# EAGLE board BeagleBone_Black_Wireless (EAGLE 7.6.0), part 1 of 3
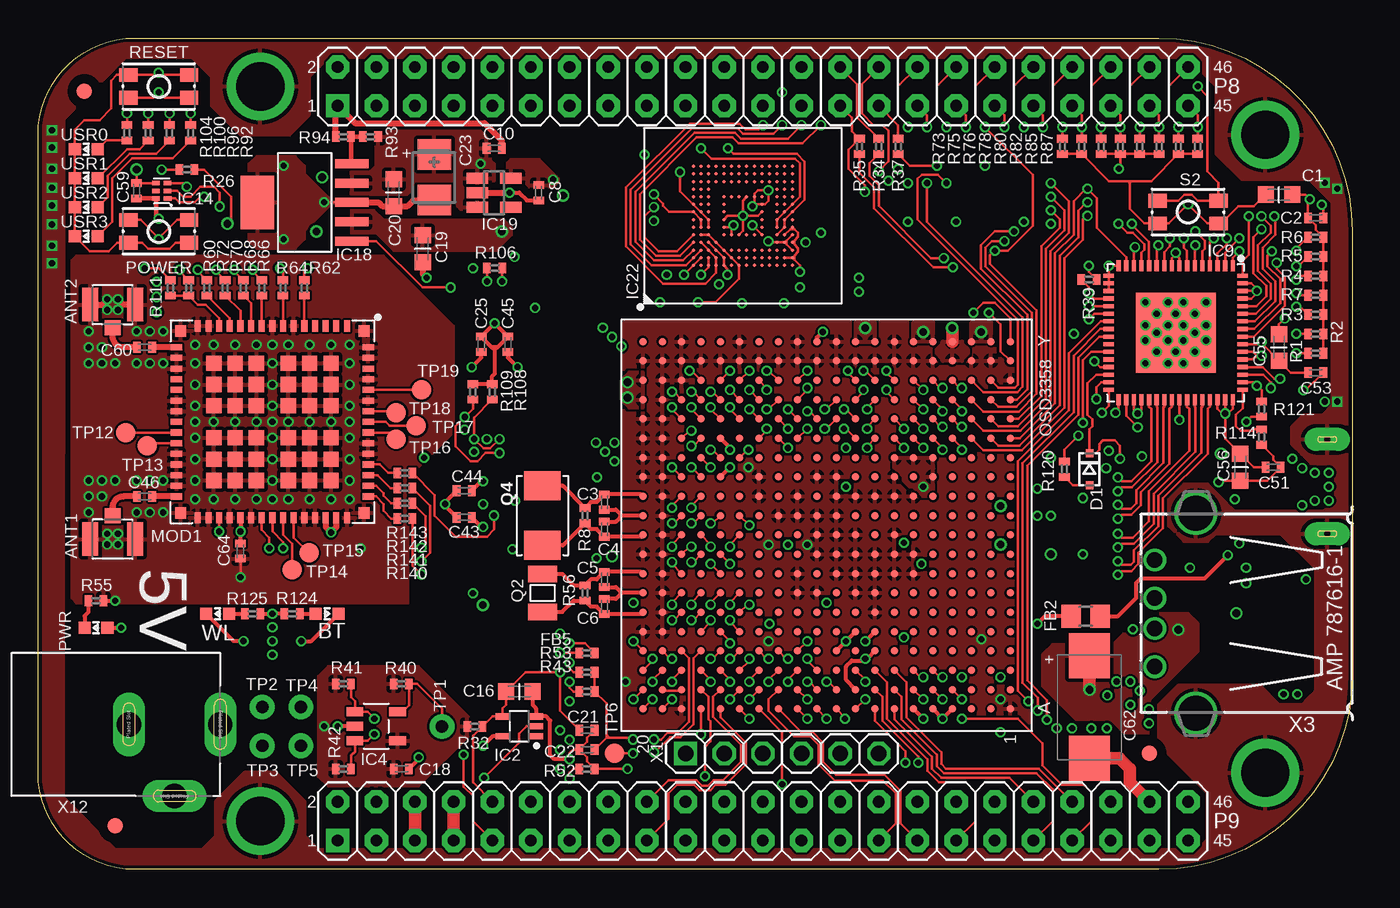
[diagram p5: board, top side]
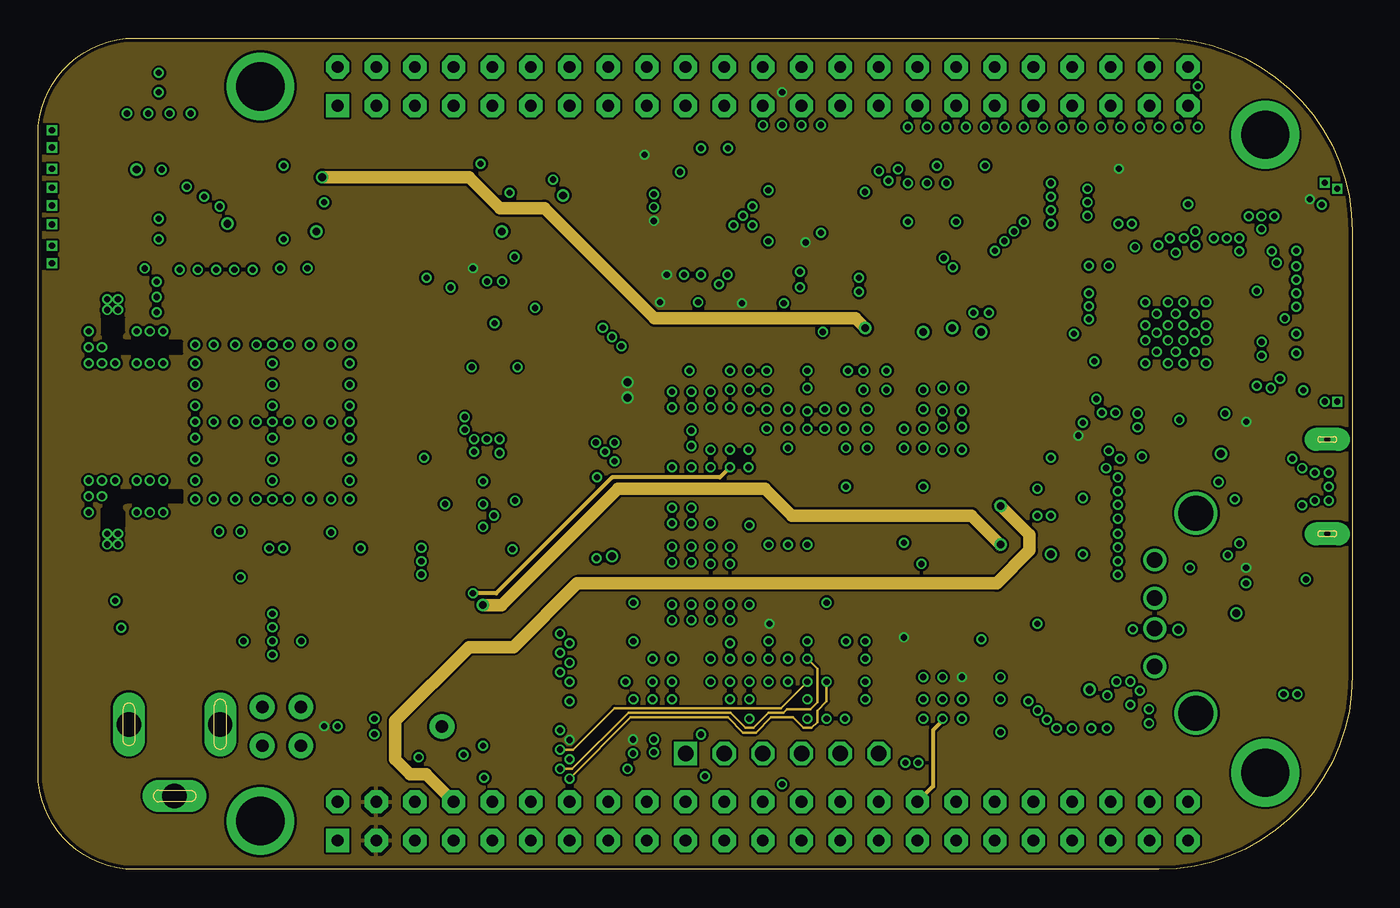
[diagram p6: board, inner layer VDD]
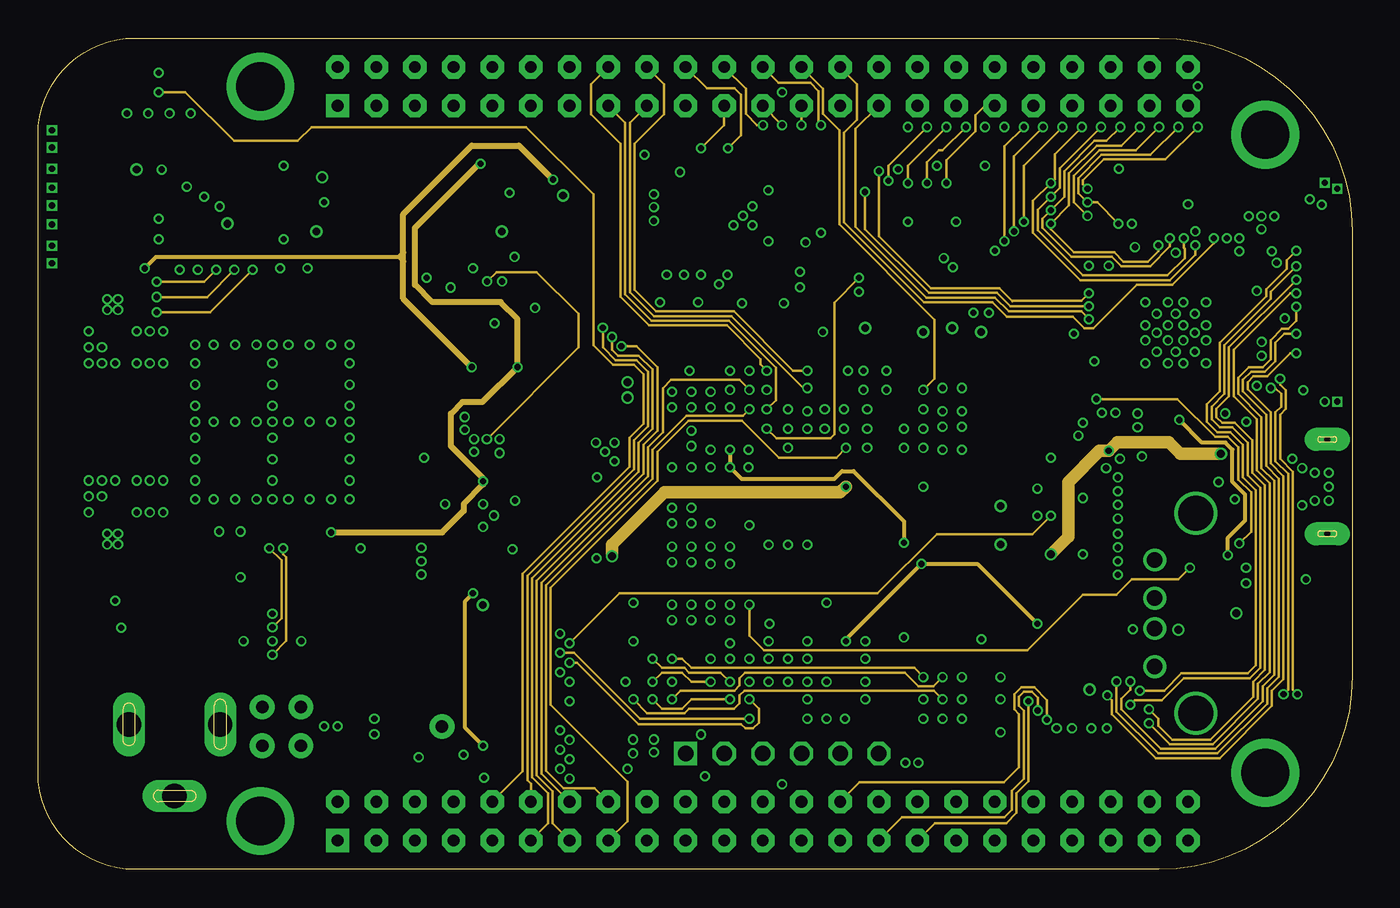
[diagram p7: board, inner layer Route3]
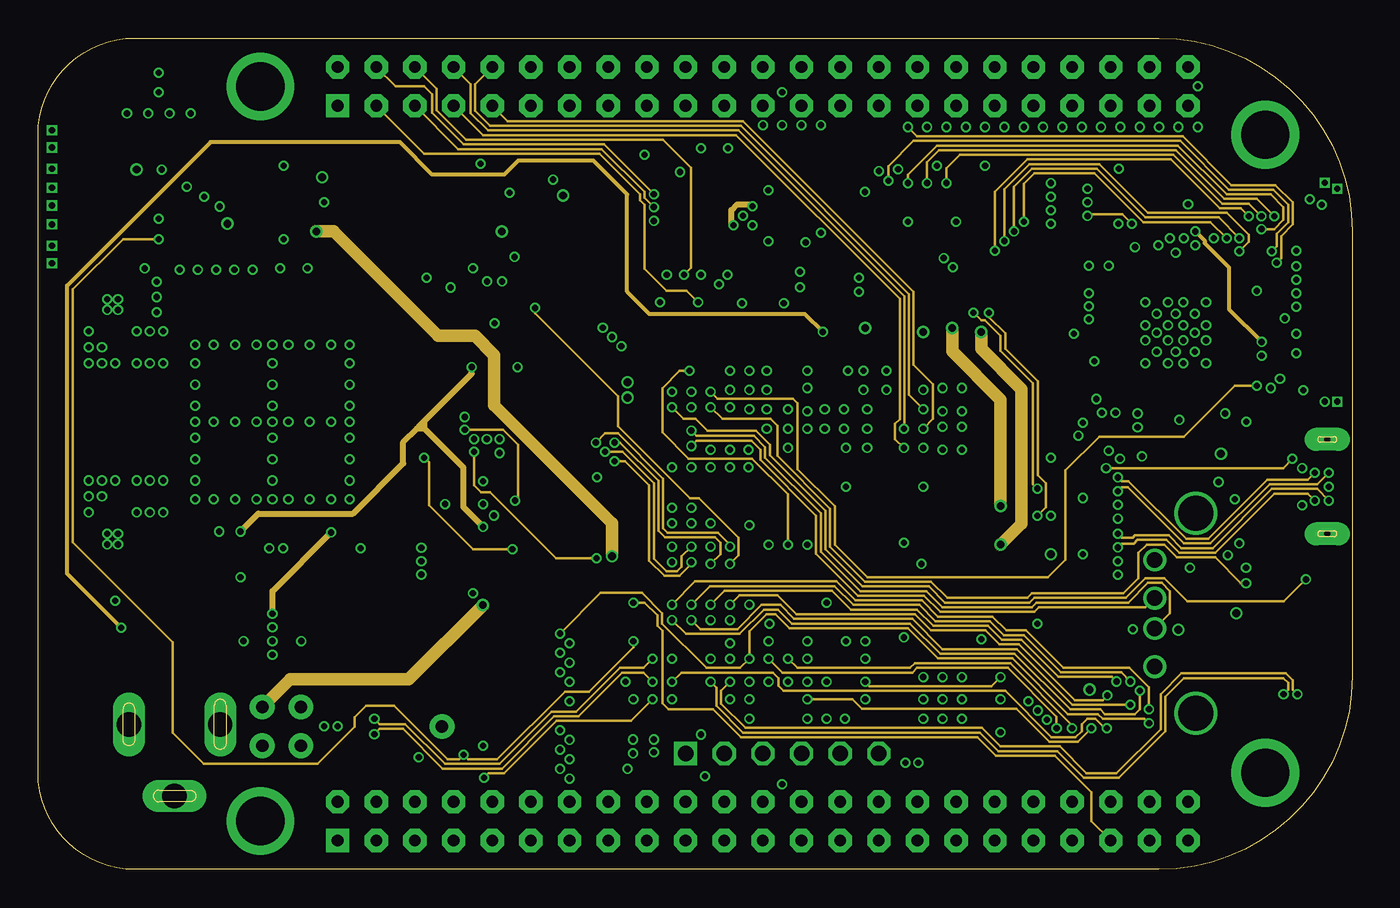
[diagram p8: board, inner layer Route14]
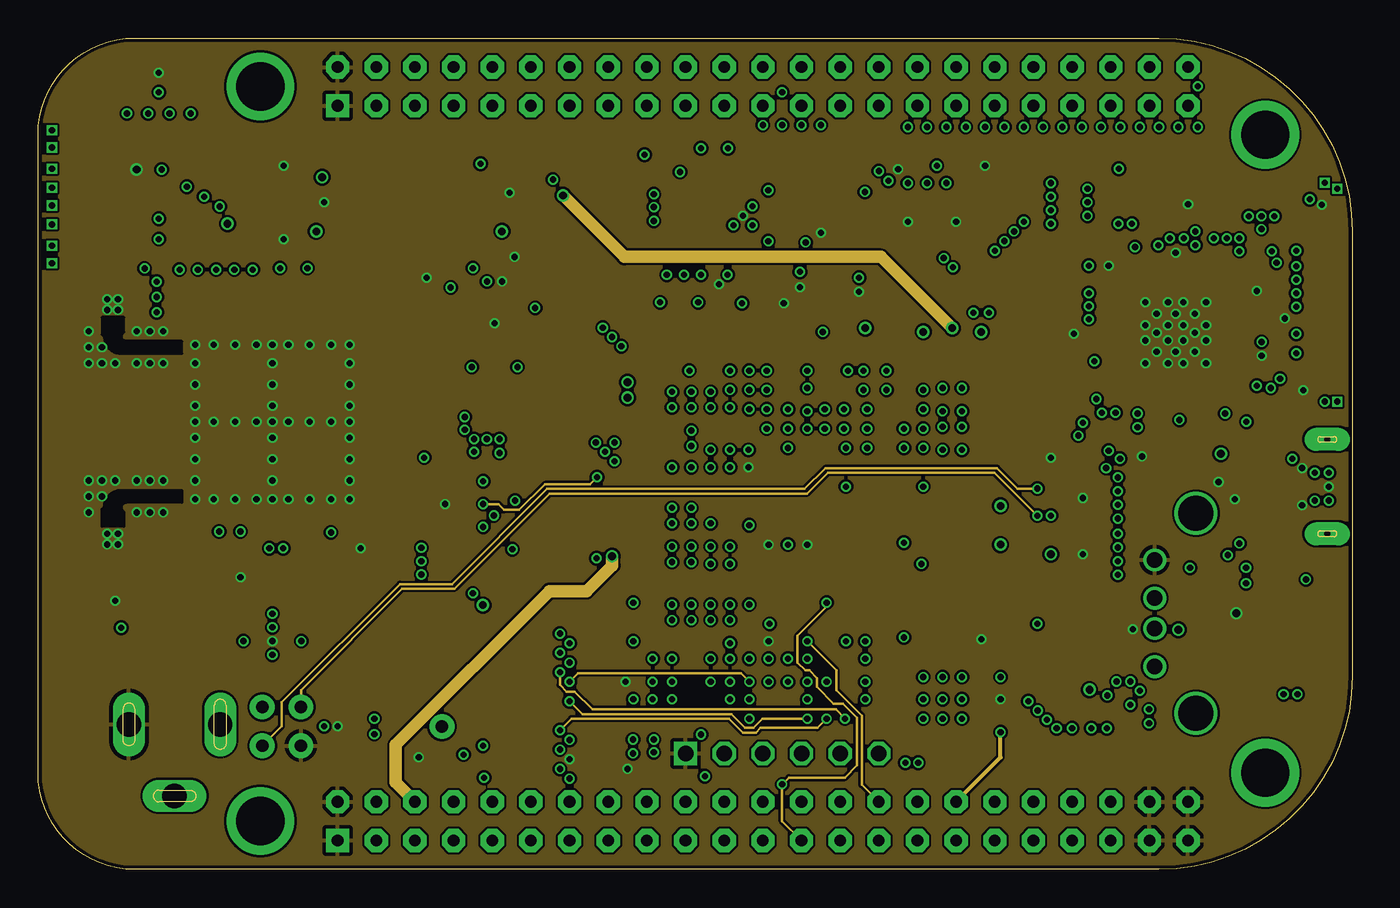
[diagram p9: board, inner layer DigitalGND]
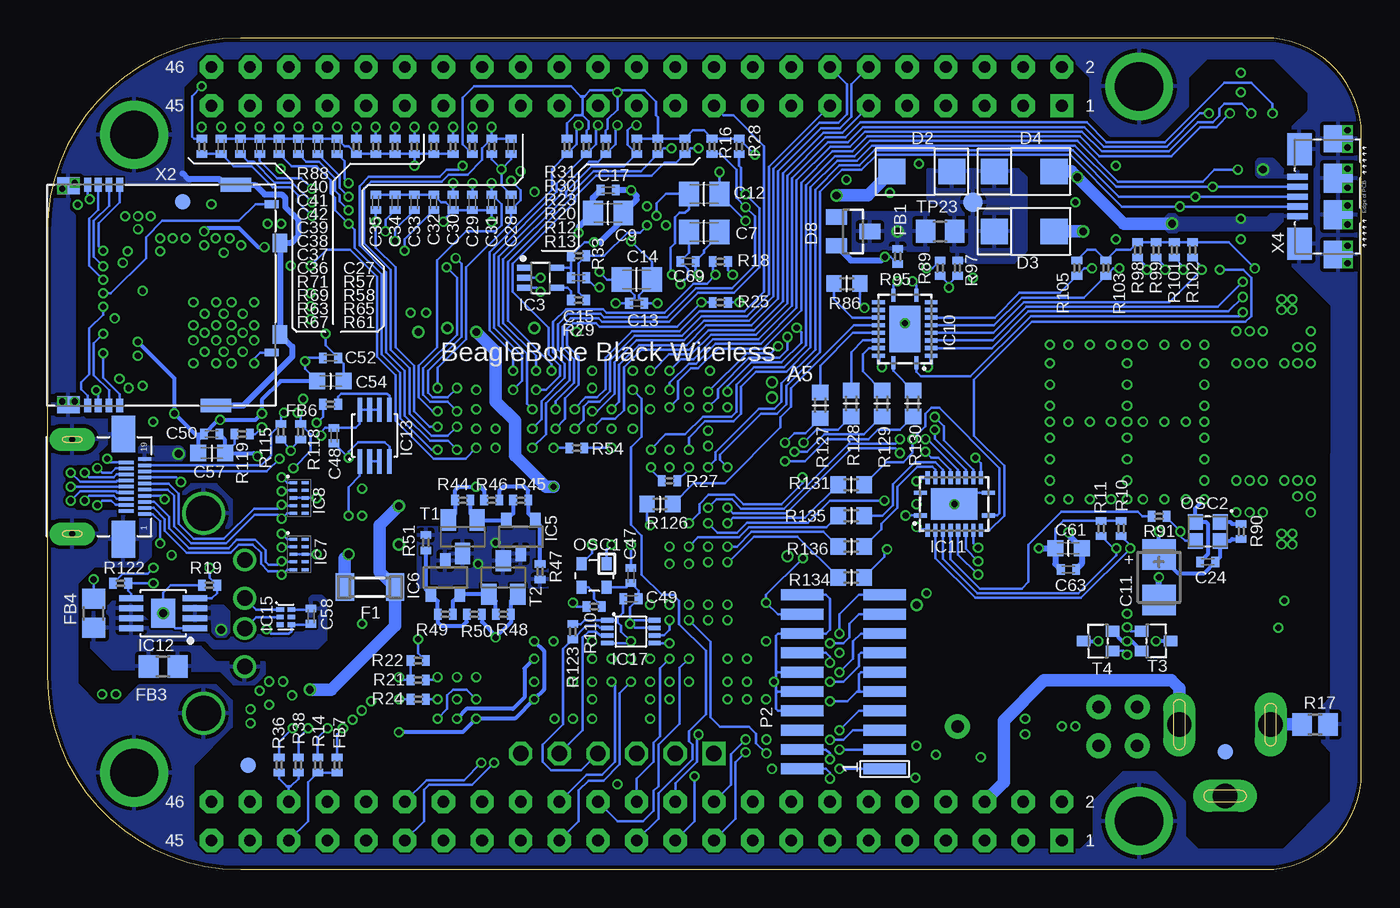
[diagram p10: board, bottom side, seen from below]

Size 86.36 x 54.61 mm. Coordinates in mm from the lower left corner, seen from the top.
Outline: 0,6.35 0,48.26 arc-90 6.35,54.61 73.66,54.61 arc-90 86.36,41.91 86.36,12.7 arc-90 73.66,0 6.35,0 arc-90 0,6.35
Copper layers (1+2+3+14+15+16): Top 0.035mm / dielectric 1.5mm / VDD 0.035mm / dielectric 0.15mm / Route3 0.035mm / dielectric 0.2mm / Route14 0.035mm / dielectric 0.15mm / DigitalGND 0.035mm / dielectric 0.2mm / Bottom 0.035mm
Design rules "default *": minimum track width 6mil, minimum drill 10mil, track to track 6mil, track to pad 6mil, pad to pad 6mil, via to via 6mil, smd to smd 6mil, copper to edge 10mil, drill to drill 8mil, minimum pad ring 10mil, minimum via ring 5mil, stop-mask expansion 4mil, vias tented up to drill 40mil, thermal gap 10mil

## Footprints (pad centres in the part's own frame; a part is rotated, then mirrored left to right if it is on the bottom)
U.FL-R-SMT-1 = smd 1.05 x 2.2: GND1 -1.475,0; GND2 1.475,0 | smd 1.05 x 1: SIG 0,-1.525
0603-LED = smd 0.8 x 0.8: A 0,0.75; K 0,-0.75
C0603K = smd 1.05 x 1.08: 1 -0.875,0; 2 0.875,0
C0402K = smd 0.5 x 0.7: 1 -0.5,0; 2 0.5,0
C0805K = smd 1.3 x 1.6: 1 -1,0; 2 1,0
CT3528 = smd 2 x 2.2: + -1.5,0; - 1.5,0
D/7343-31W = smd 2.95 x 2.7: + 3.375,0; - -3.375,0
SOD323(NXP)REFLOW = smd 0.5 x 0.5: A 1.05,0; C -1.05,0
DIODE_SMA = smd 1.778 x 1.676: A -1.905,0; K 2.032,0
SOT23 = smd 1 x 1.4: 1 -0.95,-1.1; 2 0.95,-1.1; 3 0,1.1
SM-1206 = smd 1.2 x 1.8: 1 -1.65,0; 2 1.65,0
0805-RESISTOR = smd 1.3 x 1.5: 1 -0.95,0; 2 0.95,0
R0402 = smd 0.5 x 0.7: 1 -0.5,0; 2 0.5,0
FIDUCIAL_40MIL = smd 1.016 x 1.016: P$1 0,0
OSD3358 = smd 0.5 x 0.5: A1 -12.065,-12.065; A2 -12.065,-10.795; A3 -12.065,-9.525; A4 -12.065,-8.255; A5 -12.065,-6.985; A6 -12.065,-5.715; A7 -12.065,-4.445; A8 -12.065,-3.175; A9 -12.065,-1.905; A10 -12.065,-0.635; A11 -12.065,0.635; A12 -12.065,1.905; A13 -12.065,3.175; A14 -12.065,4.445; A15 -12.065,5.715; A16 -12.065,6.985; A17 -12.065,8.255; A18 -12.065,9.525; A19 -12.065,10.795; A20 -12.065,12.065; B1 -10.795,-12.065; B2 -10.795,-10.795; B3 -10.795,-9.525; B4 -10.795,-8.255; B5 -10.795,-6.985; B6 -10.795,-5.715; B7 -10.795,-4.445; B8 -10.795,-3.175; B9 -10.795,-1.905; B10 -10.795,-0.635; B11 -10.795,0.635; B12 -10.795,1.905; B13 -10.795,3.175; B14 -10.795,4.445; B15 -10.795,5.715; B16 -10.795,6.985; B17 -10.795,8.255; B18 -10.795,9.525; B19 -10.795,10.795; B20 -10.795,12.065; C1 -9.525,-12.065; C2 -9.525,-10.795; C3 -9.525,-9.525; C4 -9.525,-8.255; C5 -9.525,-6.985; C6 -9.525,-5.715; C7 -9.525,-4.445; C8 -9.525,-3.175; C9 -9.525,-1.905; C10 -9.525,-0.635; C11 -9.525,0.635; C12 -9.525,1.905; C13 -9.525,3.175; C14 -9.525,4.445; C15 -9.525,5.715; C16 -9.525,6.985; C17 -9.525,8.255; C18 -9.525,9.525; C19 -9.525,10.795; C20 -9.525,12.065; D1 -8.255,-12.065; D2 -8.255,-10.795; D3 -8.255,-9.525; D4 -8.255,-8.255; D5 -8.255,-6.985; D6 -8.255,-5.715; D7 -8.255,-4.445; D8 -8.255,-3.175; D9 -8.255,-1.905; D10 -8.255,-0.635; D11 -8.255,0.635; D12 -8.255,1.905; D13 -8.255,3.175; D14 -8.255,4.445; D15 -8.255,5.715; D16 -8.255,6.985; D17 -8.255,8.255; D18 -8.255,9.525; D19 -8.255,10.795; D20 -8.255,12.065; E1 -6.985,-12.065; E2 -6.985,-10.795; E3 -6.985,-9.525; E4 -6.985,-8.255; E5 -6.985,-6.985; E6 -6.985,-5.715; E7 -6.985,-4.445; E8 -6.985,-3.175; E9 -6.985,-1.905; E10 -6.985,-0.635; E11 -6.985,0.635; E12 -6.985,1.905; E13 -6.985,3.175; E14 -6.985,4.445; E15 -6.985,5.715; E16 -6.985,6.985; E17 -6.985,8.255; E18 -6.985,9.525; E19 -6.985,10.795; E20 -6.985,12.065; F1 -5.715,-12.065; F2 -5.715,-10.795; F3 -5.715,-9.525; F4 -5.715,-8.255; F5 -5.715,-6.985; F6 -5.715,-5.715; F7 -5.715,-4.445; F8 -5.715,-3.175; F9 -5.715,-1.905; F10 -5.715,-0.635; F11 -5.715,0.635; F12 -5.715,1.905; F13 -5.715,3.175; F14 -5.715,4.445; F15 -5.715,5.715; F16 -5.715,6.985; F17 -5.715,8.255; F18 -5.715,9.525; F19 -5.715,10.795; F20 -5.715,12.065; G1 -4.445,-12.065; G2 -4.445,-10.795; G3 -4.445,-9.525; G4 -4.445,-8.255; G5 -4.445,-6.985; G6 -4.445,-5.715; G7 -4.445,-4.445; G8 -4.445,-3.175; G9 -4.445,-1.905; G10 -4.445,-0.635; G11 -4.445,0.635; G12 -4.445,1.905; G13 -4.445,3.175; G14 -4.445,4.445; G15 -4.445,5.715; G16 -4.445,6.985; G17 -4.445,8.255; G18 -4.445,9.525; G19 -4.445,10.795; G20 -4.445,12.065; H1 -3.175,-12.065; H2 -3.175,-10.795; H3 -3.175,-9.525; H4 -3.175,-8.255; H5 -3.175,-6.985; H6 -3.175,-5.715; H7 -3.175,-4.445; H8 -3.175,-3.175; H9 -3.175,-1.905; H10 -3.175,-0.635; H11 -3.175,0.635; H12 -3.175,1.905; H13 -3.175,3.175; H14 -3.175,4.445; H15 -3.175,5.715; H16 -3.175,6.985; H17 -3.175,8.255; H18 -3.175,9.525; H19 -3.175,10.795; H20 -3.175,12.065; J1 -1.905,-12.065; J2 -1.905,-10.795; J3 -1.905,-9.525; J4 -1.905,-8.255; J5 -1.905,-6.985; J6 -1.905,-5.715; J7 -1.905,-4.445; J8 -1.905,-3.175; J9 -1.905,-1.905; J10 -1.905,-0.635; J11 -1.905,0.635; J12 -1.905,1.905; J13 -1.905,3.175; J14 -1.905,4.445; J15 -1.905,5.715; J16 -1.905,6.985; J17 -1.905,8.255; J18 -1.905,9.525; J19 -1.905,10.795; J20 -1.905,12.065; K1 -0.635,-12.065; K2 -0.635,-10.795; K3 -0.635,-9.525; K4 -0.635,-8.255; K5 -0.635,-6.985; K6 -0.635,-5.715; K7 -0.635,-4.445; K8 -0.635,-3.175; K9 -0.635,-1.905; K10 -0.635,-0.635; K11 -0.635,0.635; K12 -0.635,1.905; K13 -0.635,3.175; K14 -0.635,4.445; K15 -0.635,5.715; K16 -0.635,6.985; K17 -0.635,8.255; K18 -0.635,9.525; K19 -0.635,10.795; K20 -0.635,12.065; L1 0.635,-12.065; L2 0.635,-10.795; L3 0.635,-9.525; L4 0.635,-8.255; L5 0.635,-6.985; L6 0.635,-5.715; L7 0.635,-4.445; L8 0.635,-3.175; L9 0.635,-1.905; L10 0.635,-0.635; L11 0.635,0.635; L12 0.635,1.905; L13 0.635,3.175; L14 0.635,4.445; L15 0.635,5.715; L16 0.635,6.985; L17 0.635,8.255; L18 0.635,9.525; L19 0.635,10.795; L20 0.635,12.065; M1 1.905,-12.065; M2 1.905,-10.795; M3 1.905,-9.525; M4 1.905,-8.255; M5 1.905,-6.985; M6 1.905,-5.715; M7 1.905,-4.445; M8 1.905,-3.175; M9 1.905,-1.905; M10 1.905,-0.635; M11 1.905,0.635; M12 1.905,1.905; M13 1.905,3.175; M14 1.905,4.445; M15 1.905,5.715; M16 1.905,6.985; M17 1.905,8.255; M18 1.905,9.525; M19 1.905,10.795; M20 1.905,12.065; N1 3.175,-12.065; N2 3.175,-10.795; N3 3.175,-9.525; N4 3.175,-8.255; N5 3.175,-6.985; N6 3.175,-5.715; N7 3.175,-4.445; N8 3.175,-3.175; N9 3.175,-1.905; N10 3.175,-0.635; N11 3.175,0.635; N12 3.175,1.905; N13 3.175,3.175; N14 3.175,4.445; N15 3.175,5.715; N16 3.175,6.985; N17 3.175,8.255; N18 3.175,9.525; N19 3.175,10.795; N20 3.175,12.065; P1 4.445,-12.065; P2 4.445,-10.795; P3 4.445,-9.525; P4 4.445,-8.255; P5 4.445,-6.985; P6 4.445,-5.715; P7 4.445,-4.445; P8 4.445,-3.175; P9 4.445,-1.905; P10 4.445,-0.635; P11 4.445,0.635; P12 4.445,1.905; P13 4.445,3.175; P14 4.445,4.445; P15 4.445,5.715; P16 4.445,6.985; P17 4.445,8.255; P18 4.445,9.525; P19 4.445,10.795; P20 4.445,12.065; R1 5.715,-12.065; R2 5.715,-10.795; R3 5.715,-9.525; R4 5.715,-8.255; R5 5.715,-6.985; R6 5.715,-5.715; R7 5.715,-4.445; R8 5.715,-3.175; R9 5.715,-1.905; R10 5.715,-0.635; R11 5.715,0.635; R12 5.715,1.905; R13 5.715,3.175; R14 5.715,4.445; R15 5.715,5.715; R16 5.715,6.985; R17 5.715,8.255; R18 5.715,9.525; R19 5.715,10.795; R20 5.715,12.065; T1 6.985,-12.065; T2 6.985,-10.795; T3 6.985,-9.525; T4 6.985,-8.255; T5 6.985,-6.985; T6 6.985,-5.715; T7 6.985,-4.445; T8 6.985,-3.175; T9 6.985,-1.905; T10 6.985,-0.635; T11 6.985,0.635; T12 6.985,1.905; T13 6.985,3.175; T14 6.985,4.445; T15 6.985,5.715; T16 6.985,6.985; T17 6.985,8.255; T18 6.985,9.525; T19 6.985,10.795; T20 6.985,12.065; U1 8.255,-12.065; U2 8.255,-10.795; U3 8.255,-9.525; U4 8.255,-8.255; U5 8.255,-6.985; U6 8.255,-5.715; U7 8.255,-4.445; U8 8.255,-3.175; U9 8.255,-1.905; U10 8.255,-0.635; U11 8.255,0.635; U12 8.255,1.905; U13 8.255,3.175; U14 8.255,4.445; U15 8.255,5.715; U16 8.255,6.985; U17 8.255,8.255; U18 8.255,9.525; U19 8.255,10.795; U20 8.255,12.065; V1 9.525,-12.065; V2 9.525,-10.795; V3 9.525,-9.525; V4 9.525,-8.255; V5 9.525,-6.985; V6 9.525,-5.715; V7 9.525,-4.445; V8 9.525,-3.175; V9 9.525,-1.905; V10 9.525,-0.635; V11 9.525,0.635; V12 9.525,1.905; V13 9.525,3.175; V14 9.525,4.445; V15 9.525,5.715; V16 9.525,6.985; V17 9.525,8.255; V18 9.525,9.525; V19 9.525,10.795; V20 9.525,12.065; W1 10.795,-12.065; W2 10.795,-10.795; W3 10.795,-9.525; W4 10.795,-8.255; W5 10.795,-6.985; W6 10.795,-5.715; W7 10.795,-4.445; W8 10.795,-3.175; W9 10.795,-1.905; W10 10.795,-0.635; W11 10.795,0.635; W12 10.795,1.905; W13 10.795,3.175; W14 10.795,4.445; W15 10.795,5.715; W16 10.795,6.985; W17 10.795,8.255; W18 10.795,9.525; W19 10.795,10.795; W20 10.795,12.065; Y1 12.065,-12.065; Y2 12.065,-10.795; Y3 12.065,-9.525; Y4 12.065,-8.255; Y5 12.065,-6.985; Y6 12.065,-5.715; Y7 12.065,-4.445; Y8 12.065,-3.175; Y9 12.065,-1.905; Y10 12.065,-0.635; Y11 12.065,0.635; Y12 12.065,1.905; Y13 12.065,3.175; Y14 12.065,4.445; Y15 12.065,5.715; Y16 12.065,6.985; Y17 12.065,8.255; Y18 12.065,9.525; Y19 12.065,10.795; Y20 12.065,12.065
SC70(TI-DCK) = smd 0.4 x 0.9: 1 0.65,1.1; 2 0,1.1; 3 -0.65,1.1; 4 -0.65,-1.1; 5 0.65,-1.1
SOT23-5(MICROCHIP) = smd 0.6 x 1.1: 1 -0.95,-1.4; 2 0,-1.4; 3 0.95,-1.4; 4 0.95,1.4; 5 -0.95,1.4
DBZ_R-PDSO-G3 = smd 0.7 x 1: 1 -0.95,-1.1; 2 0.95,-1.1; 3 0,1.1
SOT1176-1(NXP) = smd 0.2 x 0.475: 1 -1,-0.388; 2 -0.5,-0.388; 3 0,-0.388; 4 0.5,-0.388; 5 1,-0.388; 6 1,0.388; 7 0.5,0.388; 8 0,0.388; 9 -0.5,0.388; 10 -1,0.388
SOT804-4(NXP) = smd 0.7 x 0.275: 1 -4.4,3.75; 2 -4.4,3.25; 3 -4.4,2.75; 4 -4.4,2.25; 5 -4.4,1.75; 6 -4.4,1.25; 7 -4.4,0.75; 8 -4.4,0.25; 9 -4.4,-0.25; 10 -4.4,-0.75; 11 -4.4,-1.25; 12 -4.4,-1.75; 13 -4.4,-2.25; 14 -4.4,-2.75; 15 -4.4,-3.25; 16 -4.4,-3.75; 33 4.4,-3.75; 34 4.4,-3.25; 35 4.4,-2.75; 36 4.4,-2.25; 37 4.4,-1.75; 38 4.4,-1.25; 39 4.4,-0.75; 40 4.4,-0.25; 41 4.4,0.25; 42 4.4,0.75; 43 4.4,1.25; 44 4.4,1.75; 45 4.4,2.25; 46 4.4,2.75; 47 4.4,3.25; 48 4.4,3.75 | smd 0.275 x 0.7: 17 -3.75,-4.4; 18 -3.25,-4.4; 19 -2.75,-4.4; 20 -2.25,-4.4; 21 -1.75,-4.4; 22 -1.25,-4.4; 23 -0.75,-4.4; 24 -0.25,-4.4; 25 0.25,-4.4; 26 0.75,-4.4; 27 1.25,-4.4; 28 1.75,-4.4; 29 2.25,-4.4; 30 2.75,-4.4; 31 3.25,-4.4; 32 3.75,-4.4; 49 3.75,4.4; 50 3.25,4.4; 51 2.75,4.4; 52 2.25,4.4; 53 1.75,4.4; 54 1.25,4.4; 55 0.75,4.4; 56 0.25,4.4; 57 -0.25,4.4; 58 -0.75,4.4; 59 -1.25,4.4; 60 -1.75,4.4; 61 -2.25,4.4; 62 -2.75,4.4; 63 -3.25,4.4; 64 -3.75,4.4 | smd 5.25 x 5.25: 65 0,0
R-PVQFN-N20(TI) = smd 0.85 x 0.28: 1 -2.225,-0.75; 10 2.225,-0.75; 11 2.225,0.75; 20 -2.225,0.75 | smd 0.28 x 0.85: 2 -1.75,-1.725; 3 -1.25,-1.725; 4 -0.75,-1.725; 5 -0.25,-1.725; 6 0.25,-1.725; 7 0.75,-1.725; 8 1.25,-1.725; 9 1.75,-1.725; 12 1.75,1.725; 13 1.25,1.725; 14 0.75,1.725; 15 0.25,1.725; 16 -0.25,1.725; 17 -0.75,1.725; 18 -1.25,1.725; 19 -1.75,1.725 | smd 3.05 x 2.05: TP 0,0
MSOP-POWER.PAD-8(TI) = smd 0.4 x 1.6: 1 -0.975,-2.1; 2 -0.325,-2.1; 3 0.325,-2.1; 4 0.975,-2.1; 5 0.975,2.1; 6 0.325,2.1; 7 -0.325,2.1; 8 -0.975,2.1 | smd 1.89 x 1.57: 9 0,0
SM8-8(TI) = smd 0.3 x 1.6: 1 -0.975,-1.7; 2 -0.325,-1.7; 3 0.325,-1.7; 4 0.975,-1.7; 5 0.975,1.7; 6 0.325,1.7; 7 -0.325,1.7; 8 -0.975,1.7
SON-6(TI)-DRY = smd 0.3 x 0.52: 1 -0.5,-0.38 | smd 0.3 x 0.49: 2 0,-0.375; 3 0.5,-0.375; 4 0.5,0.375; 5 0,0.375; 6 -0.5,0.375
VSSOP8(TI) = smd 0.3 x 0.8: 1 -0.75,-1.55; 2 -0.25,-1.55; 3 0.25,-1.55; 4 0.75,-1.55; 5 0.75,1.55; 6 0.25,1.55; 7 -0.25,1.55; 8 -0.75,1.55
SOT-223(DCQ_R-PDSO-G6_TI) = smd 0.6 x 2.2: 1 -2.54,-3.1; 2 -1.27,-3.1; 3 0,-3.1; 4 1.27,-3.1; 5 2.54,-3.1 | smd 3.5 x 2.2: 6 0,3.1
SOT23-5 = smd 0.7 x 1.4: 1 0.95,1.1; 2 0,1.1; 3 -0.95,1.1; 4 -0.95,-1.1; 5 0.95,-1.1
MICRON_EMMC_153 = smd 0.245 x 0.245: A1 -3.25,3.25; A2 -2.75,3.25; A3 -2.25,3.25; A4 -1.75,3.25; A5 -1.25,3.25; A6 -0.75,3.25; A7 -0.25,3.25; A8 0.25,3.25; A9 0.75,3.25; A10 1.25,3.25; A11 1.75,3.25; A12 2.25,3.25; A13 2.75,3.25; A14 3.25,3.25; B1 -3.25,2.75; B2 -2.75,2.75; B3 -2.25,2.75; B4 -1.75,2.75; B5 -1.25,2.75; B6 -0.75,2.75; B7 -0.25,2.75; B8 0.25,2.75; B9 0.75,2.75; B10 1.25,2.75; B11 1.75,2.75; B12 2.25,2.75; B13 2.75,2.75; B14 3.25,2.75; C1 -3.25,2.25; C2 -2.75,2.25; C3 -2.25,2.25; C4 -1.75,2.25; C5 -1.25,2.25; C6 -0.75,2.25; C7 -0.25,2.25; C8 0.25,2.25; C9 0.75,2.25; C10 1.25,2.25; C11 1.75,2.25; C12 2.25,2.25; C13 2.75,2.25; C14 3.25,2.25; D1 -3.25,1.75; D2 -2.75,1.75; D3 -2.25,1.75; D4 -1.75,1.75; D12 2.25,1.75; D13 2.75,1.75; D14 3.25,1.75; E1 -3.25,1.25; E2 -2.75,1.25; E3 -2.25,1.25; E5 -1.25,1.25; E6 -0.75,1.25; E7 -0.25,1.25; E8 0.25,1.25; E9 0.75,1.25; E10 1.25,1.25; E12 2.25,1.25; E13 2.75,1.25; E14 3.25,1.25; F1 -3.25,0.75; F2 -2.75,0.75; F3 -2.25,0.75; F5 -1.25,0.75; F10 1.25,0.75; F12 2.25,0.75; F13 2.75,0.75; F14 3.25,0.75; G1 -3.25,0.25; G2 -2.75,0.25; G3 -2.25,0.25; G5 -1.25,0.25; G10 1.25,0.25; G12 2.25,0.25; G13 2.75,0.25; G14 3.25,0.25; H1 -3.25,-0.25; H2 -2.75,-0.25; H3 -2.25,-0.25; H5 -1.25,-0.25; H10 1.25,-0.25; H12 2.25,-0.25; H13 2.75,-0.25; H14 3.25,-0.25; J1 -3.25,-0.75; J2 -2.75,-0.75; J3 -2.25,-0.75; J5 -1.25,-0.75; J10 1.25,-0.75; J12 2.25,-0.75; J13 2.75,-0.75; J14 3.25,-0.75; K1 -3.25,-1.25; K2 -2.75,-1.25; K3 -2.25,-1.25; K5 -1.25,-1.25; K6 -0.75,-1.25; K7 -0.25,-1.25; K8 0.25,-1.25; K9 0.75,-1.25; K10 1.25,-1.25; K12 2.25,-1.25; K13 2.75,-1.25; K14 3.25,-1.25; L1 -3.25,-1.75; L2 -2.75,-1.75; L3 -2.25,-1.75; L12 2.25,-1.75; L13 2.75,-1.75; L14 3.25,-1.75; M1 -3.25,-2.25; M2 -2.75,-2.25; M3 -2.25,-2.25; M4 -1.75,-2.25; M5 -1.25,-2.25; M6 -0.75,-2.25; M7 -0.25,-2.25; M8 0.25,-2.25; M9 0.75,-2.25; M10 1.25,-2.25; M11 1.75,-2.25; M12 2.25,-2.25; M13 2.75,-2.25; M14 3.25,-2.25; N1 -3.25,-2.75; N2 -2.75,-2.75; N3 -2.25,-2.75; N4 -1.75,-2.75; N5 -1.25,-2.75; N6 -0.75,-2.75; N7 -0.25,-2.75; N8 0.25,-2.75; N9 0.75,-2.75; N10 1.25,-2.75; N11 1.75,-2.75; N12 2.25,-2.75; N13 2.75,-2.75; N14 3.25,-2.75; P1 -3.25,-3.25; P2 -2.75,-3.25; P3 -2.25,-3.25; P4 -1.75,-3.25; P5 -1.25,-3.25; P6 -0.75,-3.25; P7 -0.25,-3.25; P8 0.25,-3.25; P9 0.75,-3.25; P10 1.25,-3.25; P11 1.75,-3.25; P12 2.25,-3.25; P13 2.75,-3.25; P14 3.25,-3.25
MOUNTING_HOLE = drill 3.175 pad 4.445: P$1 0,0
MOC-100(TI) = smd 0.75 x 0.75: 1 -6.025,-5.975; 17 6.025,-5.975; 33 6.025,5.975; 49 -6.025,5.975 | smd 0.4 x 0.75: 2 -4.9,-6.3; 3 -4.2,-6.3; 4 -3.5,-6.3; 5 -2.8,-6.3; 6 -2.1,-6.3; 7 -1.4,-6.3; 8 -0.7,-6.3; 9 0,-6.3; 10 0.7,-6.3; 11 1.4,-6.3; 12 2.1,-6.3; 13 2.8,-6.3; 14 3.5,-6.3; 15 4.2,-6.3; 16 4.9,-6.3; 34 4.9,6.3; 35 4.2,6.3; 36 3.5,6.3; 37 2.8,6.3; 38 2.1,6.3; 39 1.4,6.3; 40 0.7,6.3; 41 0,6.3; 42 -0.7,6.3; 43 -1.4,6.3; 44 -2.1,6.3; 45 -2.8,6.3; 46 -3.5,6.3; 47 -4.2,6.3; 48 -4.9,6.3 | smd 0.75 x 0.4: 18 6.3,-4.9; 19 6.3,-4.2; 20 6.3,-3.5; 21 6.3,-2.8; 22 6.3,-2.1; 23 6.3,-1.4; 24 6.3,-0.7; 25 6.3,0; 26 6.3,0.7; 27 6.3,1.4; 28 6.3,2.1; 29 6.3,2.8; 30 6.3,3.5; 31 6.3,4.2; 32 6.3,4.9; 50 -6.3,4.9; 51 -6.3,4.2; 52 -6.3,3.5; 53 -6.3,2.8; 54 -6.3,2.1; 55 -6.3,1.4; 56 -6.3,0.7; 57 -6.3,0; 58 -6.3,-0.7; 59 -6.3,-1.4; 60 -6.3,-2.1; 61 -6.3,-2.8; 62 -6.3,-3.5; 63 -6.3,-4.2; 64 -6.3,-4.9 | smd 1 x 1: G1 -3.85,-3.85; G2 -2.45,-3.85; G3 -1.05,-3.85; G4 1.05,-3.85; G5 2.45,-3.85; G6 3.85,-3.85; G7 -3.85,-2.45; G8 -2.45,-2.45; G9 -1.05,-2.45; G10 1.05,-2.45; G11 2.45,-2.45; G12 3.85,-2.45; G13 -3.85,-1.05; G14 -2.45,-1.05; G15 -1.05,-1.05; G16 1.05,-1.05; G17 2.45,-1.05; G18 3.85,-1.05; G19 -3.85,1.05; G20 -2.45,1.05; G21 -1.05,1.05; G22 1.05,1.05; G23 2.45,1.05; G24 3.85,1.05; G25 -3.85,2.45; G26 -2.45,2.45; G27 -1.05,2.45; G28 1.05,2.45; G29 2.45,2.45; G30 3.85,2.45; G31 -3.85,3.85; G32 -2.45,3.85; G33 -1.05,3.85; G34 1.05,3.85; G35 2.45,3.85; G36 3.85,3.85
OSCILLATOR-2.5X2.0-BBB = smd 0.65 x 0.85: 1 -0.825,-0.775; 2 0.825,-0.775; 3 0.825,0.775; 4 -0.825,0.775
NZ2520S = smd 1 x 1: 1 -0.825,-0.625; 2 0.825,-0.625; 3 0.825,0.625; 4 -0.825,0.625
JTAG = smd 0.711 x 2.794: 1 -5.715,-2.705; 2 -5.715,2.705; 3 -4.445,-2.705; 4 -4.445,2.705; 5 -3.175,-2.705; 6 -3.175,2.705; 7 -1.905,-2.705; 8 -1.905,2.705; 9 -0.635,-2.705; 10 -0.635,2.705; 11 0.635,-2.705; 12 0.635,2.705; 13 1.905,-2.705; 14 1.905,2.705; 15 3.175,-2.705; 16 3.175,2.705; 17 4.445,-2.705; 18 4.445,2.705; 19 5.715,-2.705; 20 5.715,2.705
TH-2X23 = drill 0.762 pad 1.524 square: 1 -27.94,-1.27 | drill 0.762 pad 1.524 octagon: 2 -27.94,1.27; 3 -25.4,-1.27; 4 -25.4,1.27; 5 -22.86,-1.27; 6 -22.86,1.27; 7 -20.32,-1.27; 8 -20.32,1.27; 9 -17.78,-1.27; 10 -17.78,1.27; 11 -15.24,-1.27; 12 -15.24,1.27; 13 -12.7,-1.27; 14 -12.7,1.27; 15 -10.16,-1.27; 16 -10.16,1.27; 17 -7.62,-1.27; 18 -7.62,1.27; 19 -5.08,-1.27; 20 -5.08,1.27; 21 -2.54,-1.27; 22 -2.54,1.27; 23 0,-1.27; 24 0,1.27; 25 2.54,-1.27; 26 2.54,1.27; 27 5.08,-1.27; 28 5.08,1.27; 29 7.62,-1.27; 30 7.62,1.27; 31 10.16,-1.27; 32 10.16,1.27; 33 12.7,-1.27; 34 12.7,1.27; 35 15.24,-1.27; 36 15.24,1.27; 37 17.78,-1.27; 38 17.78,1.27; 39 20.32,-1.27; 40 20.32,1.27; 41 22.86,-1.27; 42 22.86,1.27; 43 25.4,-1.27; 44 25.4,1.27; 45 27.94,-1.27; 46 27.94,1.27
MINI_PUSHBUTTON = smd 1.2 x 0.9: 1 -2,0.75; 2 2,0.75; 3 -2,-0.75; 4 2,-0.75
CRYSTAL_3.2X1.5 = smd 1.1 x 1.9: P$1 -1.25,0; P$2 1.25,0
CRYSTAL_5X3.2MM = smd 1.9 x 2.4: 1 -1.95,0; 2 1.95,0
R0805 = smd 1.3 x 1.5: 1 -0.85,0; 2 0.85,0
R0603 = smd 1 x 1.1: 1 -0.85,0; 2 0.85,0
SOT23-BEC = smd 1 x 1.4: B -0.95,-1.1; C 0,1.1; E 0.95,-1.1
SOT-323(DIODES) = smd 0.7 x 0.9: D 0,0.95; G -0.65,-0.95; S 0.65,-0.95
TESTPAD/W_HOLE_1X1 = drill 0.813 pad 1.626: P$1 0,0
B1,27 = smd 1.27 x 1.27: TP 0,0
TH-1X6 = drill 1.016 square: 1 -6.35,0 | drill 1.016 octagon: 2 -3.81,0; 3 -1.27,0; 4 1.27,0; 5 3.81,0; 6 6.35,0
SCHA5B0200 = smd 0.9 x 0.45: 1 -7.25,3.365; 2 -7.25,2.665; 3 -7.25,1.965; 4 -7.25,1.265; 5 7.25,1.265; 6 7.25,1.965; 7 7.25,2.665; 8 7.25,3.365 | smd 0.5 x 0.9: CD -5.975,13.35; GND 3.775,13.35 | smd 0.9 x 2: CGND1 -7.25,11; CGND4 7.25,9.7 | smd 1.1 x 1.5: CGND2 -7.188,0; CGND3 7.188,0 | smd 1.2 x 0.95: CGND5 2.575,13.9; CGND6 -3.425,13.9
USB_HOST_HORIZONTAL_W/CHASSIS_GND = drill 1: 1 -3.5,12.99; 2 -1,12.99; 3 1,12.99; 4 3.5,12.99 | drill 2.3: 5 -6.57,10.28; 6 6.57,10.28
10118192-0001LF(MICRO-USB-B-AMPHENOL-FCI) = smd 1.8 x 1.9: CGND1 -3.8,0; CGND4 3.8,0 | smd 1.9 x 1.9: CGND2 -1.2,0; CGND3 1.2,0 | smd 2.1 x 1.6: CGND5 3.1,2.55; CGND6 -3.1,2.55 | smd 0.4 x 1.35: D+ 0,2.675; D- -0.65,2.675; GND 1.3,2.675; ID 0.65,2.675; VBUS -1.3,2.675
HDMI-TYPE-D-10118241 = smd 0.23 x 0.85: 1 1.8,4.765; 3 1.4,4.765; 5 1,4.765; 7 0.6,4.765; 9 0.2,4.765; 11 -0.2,4.765; 13 -0.6,4.765; 15 -1,4.765; 17 -1.4,4.765; 19 -1.8,4.765 | smd 0.23 x 1: 2 1.6,3.54; 4 1.2,3.54; 6 0.8,3.54; 8 0.4,3.54; 10 0,3.54; 12 -0.4,3.54; 14 -0.8,3.54; 16 -1.2,3.54; 18 -1.6,3.54 | drill 0.381 pad 1.5 long: CG1 3.1,0; CG2 -3.1,0 | smd 2.413 x 1.524: CG3 3.45,3.36; CG4 -3.45,3.36
PJ-102B_POWER_CON = drill 1.6 long: IN -6,0; OUT 0,0; OUT_CON -3,4.7

## Placement (x,y rotation side)
ANT1  U.FL-R-SMT-1(10)  [U.FL-R-SMT-1]  4.9,21.7 180 top
ANT2  U.FL-R-SMT-1(10)  [U.FL-R-SMT-1]  4.9,37.1 0 top
BT  LTST-C191TBKT  [0603-LED]  19,16.8 90 top
C1  10uF,10V  [C0603K]  81.53,44.32 180 top
C2  .1uF, 6.3V  [C0402K]  83.95,42.8 0 top
C3  18pF, 50V  [C0402K]  37.21,24.13 270 top
C4  18pF, 50V  [C0402K]  37.21,22.35 90 top
C5  18pF, 50V  [C0402K]  37.21,19.05 270 top
C6  18pF, 50V  [C0402K]  37.21,17.27 90 top
C7  4.7uF, 6.3V  [C0805K]  43.19,41.88 180 bottom
C8  1uF  [C0402K]  32.89,44.45 270 top
C9  2.2uF, 6.3V  [C0805K]  49.5,43.12 180 bottom
C10  1uF  [C0402K]  29.97,47.37 0 top
C11  47uF DNP  [CT3528]  13.3,19.2 270 bottom
C12  2.2uF, 6.3V  [C0805K]  43.19,44.38 180 bottom
C13  .1uF, 6.3V  [C0402K]  47.62,37.19 180 bottom
C14  2.2uF, 6.3V  [C0805K]  47.62,38.75 180 bottom
C15  .1uF, 6.3V  [C0402K]  51.44,38.86 0 bottom
C16  2.2uF, 6.3V  [C0603K]  31.62,11.68 0 top
C17  .1uF, 6.3V  [C0402K]  49.5,44.62 180 bottom
C18  .1uF, 6.3V  [C0402K]  23.88,6.6 0 top
C19  10uF, 6.3V  [C0603K]  25.27,40.77 270 top
C20  10uF, 6.3V  [C0603K]  23.37,44.45 270 top
C21  .1uF, 6.3V  [C0402K]  36.07,9.14 0 top
C22  .1uF, 6.3V  [C0402K]  36.07,7.87 180 top
C23  47uF DNP  [CT3528]  26.04,45.47 270 top
C24  .1uF, 6.3V  [C0402K]  10.1,20.2 180 bottom
C25  .1uF, 6.3V  [C0402K]  29.12,34.5 90 top
C27  47pF, 6.3V  [C0402K]  55.88,47.5 270 bottom
C28  47pF, 6.3V  [C0402K]  55.88,43.81 90 bottom
C29  47pF, 6.3V  [C0402K]  58.42,43.81 270 bottom
C30  47pF, 6.3V  [C0402K]  59.69,43.81 270 bottom
C31  47pF, 6.3V  [C0402K]  57.15,43.81 270 bottom
C32  47pF, 6.3V  [C0402K]  60.96,43.81 90 bottom
C33  47pF, 6.3V  [C0402K]  62.23,43.81 90 bottom
C34  47pF, 6.3V  [C0402K]  63.5,43.81 90 bottom
C35  47pF, 6.3V  [C0402K]  64.77,43.81 90 bottom
C36  47pF, 6.3V  [C0402K]  67.31,47.5 90 bottom
C37  47pF, 6.3V  [C0402K]  68.58,47.5 90 bottom
C38  47pF, 6.3V  [C0402K]  69.85,47.5 90 bottom
C39  47pF, 6.3V  [C0402K]  71.12,47.5 90 bottom
C40  47pF, 6.3V  [C0402K]  74.93,47.5 90 bottom
C41  47pF, 6.3V  [C0402K]  73.66,47.5 90 bottom
C42  47pF, 6.3V  [C0402K]  72.39,47.5 90 bottom
C43  .1uF, 6.3V  [C0402K]  28,23.12 180 top
C44  .1uF, 6.3V  [C0402K]  28,24.88 180 top
C45  .1uF, 6.3V  [C0402K]  30.88,34.5 90 top
C46  10pF  [C0402K]  7,24.5 0 top
C47  .1uF, 6.3V  [C0402K]  48.01,19.3 90 bottom
C48  .1uF, 6.3V  [C0402K]  67.51,28.5 270 bottom
C49  .1uF, 6.3V  [C0402K]  48.01,17.78 180 bottom
C50  .1uF, 6.3V  [C0402K]  75.55,28.6 0 bottom
C51  .1uF, 6.3V  [C0402K]  81.15,26.42 0 top
C52  .1uF, 6.3V  [C0402K]  67.74,33.6 0 bottom
C53  .1uF, 6.3V  [C0402K]  83.95,32.64 0 top
C54  2.2uF, 6.3V  [C0603K]  67.74,32.08 0 bottom
C55  2.2uF, 6.3V  [C0603K]  81.53,34.29 90 top
C56  2.2uF, 6.3V  [C0603K]  78.99,26.42 270 top
C57  2.2uF, 6.3V  [C0603K]  75.55,27.35 0 bottom
C58  .1uF, 6.3V  [C0402K]  69.02,16.64 270 bottom
C59  .1uF, 6.3V  [C0402K]  6.48,44.58 90 top
C60  10pF  [C0402K]  7,34.3 0 top
C61  10uF, 6.3V  [C0603K]  19.25,21.1 180 bottom
C62  220uF 6.3V  [D/7343-31W]  69.09,10.67 90 top
C63  .1uF, 6.3V  [C0402K]  19.25,19.7 180 bottom
C64  1uF, 6.3V  [C0402K]  13.3,20.91 270 top
C69  .1uF, 6.3V  [C0402K]  44.25,39.94 180 bottom
D1  RB751V40,115  [SOD323(NXP)REFLOW]  69.09,26.29 270 top
D2  STPS140A DNP  [DIODE_SMA]  28.96,45.85 0 bottom
D3  STPS140A  [DIODE_SMA]  22.1,41.91 180 bottom
D4  STPS140A  [DIODE_SMA]  22.1,45.85 180 bottom
D8  BAT54C  [SOT23]  33.4,41.91 270 bottom
F1  1206L025YR  [SM-1206]  65.15,18.54 0 bottom
FB1  220 Ohm 800mA  [0805-RESISTOR]  27.69,41.91 180 bottom
FB2  2.5k Ohm (BLM18BD252SN1D)  [0805-RESISTOR]  68.83,16.64 0 top
FB3  150 Ohm 800mA  [0805-RESISTOR]  78.74,13.34 0 bottom
FB4  0.1 Ohm, 0805  [0805-RESISTOR]  83.31,16.83 90 bottom
FB5  1k BLM15AG102SN1D  [R0402]  36.07,14.22 0 top
FB6  1k BLM15AG102SN1D  [R0402]  67.74,30.56 180 bottom
FB7  1k BLM15AG102SN1D  [R0402]  67.31,6.86 90 bottom
FUD1  FIDUCIAL  [FIDUCIAL_40MIL]  73.03,7.62 0 top
FUD2  FIDUCIAL  [FIDUCIAL_40MIL]  3.05,51.12 270 top
FUD3  FIDUCIAL  [FIDUCIAL_40MIL]  5.08,2.86 0 top
FUD4  FIDUCIAL  [FIDUCIAL_40MIL]  73.15,6.86 0 bottom
FUD5  FIDUCIAL  [FIDUCIAL_40MIL]  77.44,43.84 0 bottom
FUD6  FIDUCIAL  [FIDUCIAL_40MIL]  8.94,7.75 0 bottom
IC1  OSD3358  [OSD3358]  51.82,22.61 90 top
IC2  SN74LVC1G07DCK  [SC70(TI-DCK)]  31.62,9.4 270 top
IC3  SN74LVC1G06DCK  [SC70(TI-DCK)]  53.95,38.86 90 bottom
IC4  24LC32AT-I/OT  [SOT23-5(MICROCHIP)]  22.23,9.4 270 top
IC5  TLVH431 (SOT-23-3)  [DBZ_R-PDSO-G3]  55.24,21.84 180 bottom
IC6  DNP TLVH431 (SOT-23-3)  [DBZ_R-PDSO-G3]  60.2,19.18 0 bottom
IC7  IP4283CZ10-TBR  [SOT1176-1(NXP)]  69.8,20.7 270 bottom
IC8  IP4283CZ10-TBR  [SOT1176-1(NXP)]  69.8,24.4 270 bottom
IC9  TDA19988BHN/C1,557  [SOT804-4(NXP)]  74.75,35.25 270 top
IC10  TXS0108ERGYR  [R-PVQFN-N20(TI)]  30,35.5 90 bottom
IC11  TXS0108ERGYR  [R-PVQFN-N20(TI)]  26.75,24 0 bottom
IC12  TPS2051BDGN  [MSOP-POWER.PAD-8(TI)]  78.74,16.83 90 bottom
IC13  SN74AUC1G74  [SM8-8(TI)]  64.84,28.5 0 bottom
IC14  TPD4S012DRY  [SON-6(TI)-DRY]  8.13,44.58 90 top
IC15  TPD4S012DRY  [SON-6(TI)-DRY]  70.68,16.57 270 bottom
IC17  SN74LVC2G241DCUR  [VSSOP8(TI)]  48.01,15.62 270 bottom
IC18  TL1963ADCQR  [SOT-223(DCQ_R-PDSO-G6_TI)]  17.53,43.81 90 top
IC19  AP2112K-1.8TRG1 3.3V  [SOT23-5]  29.97,44.45 90 top
IC22  [MICRON_EMMC_153]  46.31,42.94 90 top
MGT1  MOUNTING_HOLE  [MOUNTING_HOLE]  14.61,51.44 0 top
MGT2  MOUNTING_HOLE  [MOUNTING_HOLE]  80.64,48.26 0 top
MGT3  MOUNTING_HOLE  [MOUNTING_HOLE]  80.64,6.35 0 top
MGT4  MOUNTING_HOLE  [MOUNTING_HOLE]  14.61,3.17 0 top
MOD1  WL1835MODGBMOCT  [MOC-100(TI)]  15.4,29.4 180 top
OSC1  ASDMB-24.576MHZ-LC-T  [OSCILLATOR-2.5X2.0-BBB]  50.42,19.3 180 bottom
OSC2  NZ2520SB-32.768KHZ-NSA3534C  [NZ2520S]  10.1,22.2 180 bottom
P2  [JTAG]  34.04,12.32 90 bottom
P8  [TH-2X23]  47.62,51.44 0 top
P9  [TH-2X23]  47.62,3.17 0 top
POWER  MINI_PUSHBUTTON  [MINI_PUSHBUTTON]  7.94,41.91 180 top
PWR  LTST-C191TBKT  [0603-LED]  3.81,15.88 270 top
Q2  32.768kHz  [CRYSTAL_3.2X1.5]  33.15,18.16 270 top
Q4  24 MHz  [CRYSTAL_5X3.2MM]  33.15,23.24 90 top
R1  10k, 1%  [R0402]  83.95,33.91 0 top
R2  10k, 1%  [R0402]  83.95,35.18 0 top
R3  10k, 1%  [R0402]  83.95,36.45 0 top
R4  10k, 1%  [R0402]  83.95,38.99 0 top
R5  10k, 1%  [R0402]  83.95,40.26 0 top
R6  10k, 1%  [R0402]  83.95,41.53 0 top
R7  10k, 1%  [R0402]  83.95,37.72 0 top
R8  1M, 1%  [R0402]  35.94,23.24 90 top
R10  150k  [R0402]  15.8,22.4 90 bottom
R11  150k  [R0402]  17.1,22.4 90 bottom
R12  10k, 1%  [R0402]  50.93,47.5 90 bottom
R13  10k, 1%  [R0402]  52.2,47.5 90 bottom
R14  0, 1%  [R0402]  68.58,6.86 90 bottom
R16  10k, 1%  [R0402]  42.67,47.5 90 bottom
R17  .1, 0805  [R0805]  3.05,9.53 0 bottom
R18  10k, 1%  [R0402]  42.12,39.94 0 bottom
R19  10k, 1%  [R0402]  75.69,18.67 180 bottom
R20  10k, 1%  [R0402]  49.66,47.5 90 bottom
R21  4.75k, 1%  [R0402]  61.98,12.45 180 bottom
R22  4.75k, 1%  [R0402]  61.98,13.72 0 bottom
R23  10k, 1%  [R0402]  47.62,47.5 90 bottom
R24  10k, 1%  [R0402]  61.98,11.18 0 bottom
R25  10k, 1%  [R0402]  42.12,37.25 0 bottom
R26  0, 1%  [R0402]  9.78,45.97 0 top
R27  0, 1%  [R0402]  45.47,25.53 180 bottom
R28  10k, 1%  [R0402]  40.89,47.5 90 bottom
R29  0, 1%  [R0402]  51.44,37.41 180 bottom
R30  10k, 1%  [R0402]  46.23,47.5 90 bottom
R31  10k, 1%  [R0402]  44.45,47.5 90 bottom
R32  10k, 1%  [R0402]  28.7,9.4 0 top
R33  10k, 1%  [R0402]  51.44,40.31 180 bottom
R34  22  [R0402]  55.24,47.5 270 top
R35  0, 1%  [R0402]  53.98,47.5 270 top
R36  0, 1%  [R0402]  71.12,6.86 90 bottom
R37  0, 1%  [R0402]  56.52,47.5 270 top
R38  0, 1%  [R0402]  69.85,6.86 90 bottom
R39  0, 1%  [R0402]  69.05,38.75 0 top
R40  10k, 1%  [R0402]  23.88,12.19 0 top
R41  1.5k, 1%  [R0402]  20.07,12.19 0 top
R42  1.5k, 1%  [R0402]  20.07,6.6 0 top
R43  4.75k, 1%  [R0402]  36.07,11.68 180 top
R44  499  [R0402]  59.05,24.26 0 bottom
R45  DNP  [R0402]  55.24,24.26 0 bottom
R46  10k 1%  [R0402]  57.15,24.26 0 bottom
R47  40.2k 1%  [R0402]  53.98,19.56 270 bottom
R48  DNP 499  [R0402]  56.39,16.76 180 bottom
R49  DNP  [R0402]  60.2,16.76 180 bottom
R50  DNP 10k 1%  [R0402]  58.29,16.76 180 bottom
R51  DNP 40.2k 1%  [R0402]  61.47,21.46 90 bottom
R52  4.75k, 1%  [R0402]  36.07,6.6 0 top
R53  4.75k, 1%  [R0402]  36.07,12.95 180 top
R54  0, 1%  [R0402]  51.56,27.69 0 bottom
R55  4.75k, 1%  [R0402]  3.81,17.65 180 top
R56  DNP 1M, 1%  [R0402]  35.94,18.16 90 top
R57  100k, 1%  [R0402]  57.15,47.5 90 bottom
R58  100k, 1%  [R0402]  58.42,47.5 270 bottom
R60  33, 5%  [R0402]  9.9,38.2 90 top
R61  100k, 1%  [R0402]  60.96,47.5 90 bottom
R62  33, 5%  [R0402]  17.5,38.2 90 top
R63  100k, 1%  [R0402]  63.5,47.5 90 bottom
R64  33, 5%  [R0402]  16.1,38.2 90 top
R65  100k, 1%  [R0402]  59.69,47.5 90 bottom
R66  33, 5%  [R0402]  14.7,38.2 90 top
R67  100k, 1%  [R0402]  62.23,47.5 90 bottom
R68  33, 5%  [R0402]  13.5,38.2 90 top
R69  100k, 1%  [R0402]  64.77,47.5 90 bottom
R70  33, 5%  [R0402]  12.3,38.2 90 top
R71  100k, 1%  [R0402]  66.04,47.5 90 bottom
R72  33, 5%  [R0402]  11.1,38.2 90 top
R73  100k, 1%  [R0402]  67.31,47.5 90 top
R75  100k, 1%  [R0402]  68.58,47.5 90 top
R76  100k, 1%  [R0402]  69.85,47.5 270 top
R78  100k, 1%  [R0402]  71.12,47.5 270 top
R80  100k, 1%  [R0402]  72.39,47.5 270 top
R82  100k, 1%  [R0402]  73.66,47.5 270 top
R85  100k, 1%  [R0402]  74.93,47.5 90 top
R86  33, 5%  [R0603]  33.81,38.48 180 bottom
R87  100k, 1%  [R0402]  76.2,47.5 90 top
R88  100, 1%  [R0402]  76.2,47.5 90 bottom
R89  1k  [R0402]  27.69,39.5 270 bottom
R90  1k  [R0402]  7.9,22.2 90 bottom
R91  0 DNP  [R0402]  13.3,23.2 0 bottom
R92  1k  [R0402]  10.03,48.39 90 top
R93  7.15k  [R0402]  21.84,48.13 180 top
R94  4.12k  [R0402]  20.07,48.13 180 top
R95  1M  [R0402]  30.48,40.26 270 bottom
R96  1k  [R0402]  8.64,48.39 90 top
R97  DNP 1k  [R0402]  26.54,39.5 270 bottom
R98  10k  [R0402]  14.7,40.7 270 bottom
R99  10k  [R0402]  13.5,40.7 270 bottom
R100  1k  [R0402]  7.24,48.39 90 top
R101  10k  [R0402]  12.3,40.7 270 bottom
R102  10k  [R0402]  11.1,40.7 270 bottom
R103  10k  [R0402]  16.8,39.5 270 bottom
R104  1k  [R0402]  5.84,48.39 90 top
R105  10k  [R0402]  18.7,39.5 270 bottom
R106  1.5k  [R0402]  30,39.5 0 top
R108  DNP 1k  [R0402]  29.84,31.37 90 top
R109  DNP 1k  [R0402]  28.57,31.37 90 top
R110  33  [R0402]  50.42,17.27 180 bottom
R111  DNP 10k  [R0402]  8.7,38.2 270 top
R114  0, 1%  [R0402]  80.4,28.4 90 top
R115  1.5k, 1%  [R0402]  71,28.75 90 bottom
R118  1.5k, 1%  [R0402]  69.7,28.75 90 bottom
R119  10k, 1%  [R0402]  73.55,28.6 180 bottom
R120  27k, 1%  [R0402]  67.44,26.29 270 top
R121  10k, 1%  [R0402]  80.4,30.25 90 top
R122  0, 1%  [R0402]  81.53,18.8 0 bottom
R123  100k, 1%  [R0402]  51.82,15.62 90 bottom
R124  1k  [R0402]  16.7,16.8 180 top
R125  1k  [R0402]  14.1,16.8 0 top
R126  33, 5%  [R0603]  46.1,24 0 bottom
R127  33, 5%  [R0603]  35.56,30.48 90 bottom
R128  33, 5%  [R0603]  33.53,30.61 90 bottom
R129  33, 5%  [R0603]  31.5,30.61 90 bottom
R130  33, 5%  [R0603]  29.46,30.61 90 bottom
R131  33, 5%  [R0603]  33.53,25.27 180 bottom
R134  33, 5%  [R0603]  33.53,19.18 0 bottom
R135  33, 5%  [R0603]  33.53,23.24 0 bottom
R136  33, 5%  [R0603]  33.53,21.21 0 bottom
R140  33, 5%  [R0402]  24.1,23.05 0 top
R141  33, 5%  [R0402]  24.1,24.05 0 top
R142  33, 5%  [R0402]  24.1,25.05 0 top
R143  33, 5%  [R0402]  24.1,26.05 0 top
RESET  MINI_PUSHBUTTON  [MINI_PUSHBUTTON]  7.94,51.44 0 top
S2  MINI_PUSHBUTTON  [MINI_PUSHBUTTON]  75.56,43.18 0 top
T1  MMBT2907  [SOT23-BEC]  59.05,21.84 180 bottom
T2  DNP MMBT2907  [SOT23-BEC]  56.39,19.18 0 bottom
T3  BSS138W-7-F  [SOT-323(DIODES)]  13.5,15 270 bottom
T4  BSS138W-7-F  [SOT-323(DIODES)]  17.3,15 90 bottom
TP1  TESTPAD/W_HOLE_1X1  [TESTPAD/W_HOLE_1X1]  26.54,9.4 270 top
TP2  TESTPAD/W_HOLE_1X1  [TESTPAD/W_HOLE_1X1]  14.73,10.67 0 top
TP3  TESTPAD/W_HOLE_1X1  [TESTPAD/W_HOLE_1X1]  14.73,8.13 0 top
TP4  TESTPAD/W_HOLE_1X1  [TESTPAD/W_HOLE_1X1]  17.27,10.67 0 top
TP5  TESTPAD/W_HOLE_1X1  [TESTPAD/W_HOLE_1X1]  17.27,8.13 0 top
TP6  PTR1B1,27  [B1,27]  37.87,7.62 90 top
TP12  PTR1B1,27  [B1,27]  5.78,28.7 0 top
TP13  PTR1B1,27  [B1,27]  7.17,27.82 0 top
TP14  PTR1B1,27  [B1,27]  16.7,19.7 0 top
TP15  PTR1B1,27  [B1,27]  17.8,20.8 0 top
TP16  PTR1B1,27  [B1,27]  23.54,28.26 0 top
TP17  PTR1B1,27  [B1,27]  24.85,29.14 0 top
TP18  PTR1B1,27  [B1,27]  23.54,30.01 0 top
TP19  PTR1B1,27  [B1,27]  25.2,31.5 0 top
TP23  PTR1B1,27  [B1,27]  25.53,43.81 0 bottom
USR0  LTST-C191TBKT  [0603-LED]  3.17,47.31 270 top
USR1  LTST-C191TBKT  [0603-LED]  3.17,45.4 270 top
USR2  LTST-C191TBKT  [0603-LED]  3.17,43.5 270 top
USR3  LTST-C191TBKT  [0603-LED]  3.17,41.59 270 top
WL  LTST-C191TBKT  [0603-LED]  11.8,16.8 270 top
X1  [TH-1X6]  48.9,7.62 0 top
X2  SCHA5B0200  [SCHA5B0200]  84.96,37.72 270 bottom
X3  [USB_HOST_HORIZONTAL_W/CHASSIS_GND]  86.36,16.83 90 top
X4  10118192-0001LF  [10118192-0001LF(MICRO-USB-B-AMPHENOL-FCI)]  1.52,44.2 90 bottom
X5  10118241-001RLF  [HDMI-TYPE-D-10118241]  84.71,25.15 270 bottom
X12  [PJ-102B_POWER_CON]  5.97,9.53 180 top

## Tracks (layer width: path | path; a pad name or v marks a point on that pad's centre or on a via)
1.8V-WIFI  (via drill 0.41)
  Top 0.152: R111.1 7.92,39.48 v7,39.48
  Top 0.254: v28.5,33 29.12,33.62 C25.1 | v29.25,22.5 29.12,22.5 C43.1 | MOD1.38 v13.3,22.2 C64.1
  Route3 0.254: v7,39.48 7.76,40.23 23.7,40.23 | 23.7,40.23 24,40.54 | 23.7,40.23 24,39.93
  Route3 0.406: v28.5,33 24,37.5 24,39.93 24,40.54 24,43.05 28.5,47.55 31.6,47.55 v33.83,45.31
  Route14 0.406: v13.3,22.2 14.47,23.37 20.7,23.37 24,26.67 24,28.07 24.89,28.96 | 24.89,28.96 25.15,29.21 | 25.15,29.21 25.4,29.46 | 25.4,29.46 28.5,32.56 v28.5,33 | 25.15,29.21 25.4,28.96 | 25.4,28.96 27.94,26.42 27.94,23.81 v29.25,22.5 | 25.4,28.96 24.89,28.96 | 25.4,28.96 25.4,29.46
  Bottom 0.152: R105.1 18,40.7 17.5,40.7 R103.1 16.1,40.7 15.2,40.7 R98.1 R99.1 R101.1 R102.1 8.72,41.2 v7,39.48
  Bottom 0.254: IC11.2 29.02,22.27 v29.25,22.5 | IC10.2 28.27,33.23 v28.5,33 | R90.1 8.5,21.7 8.62,21.57 OSC2.4 9.28,20.52 C24.1 10.37,19.43 12.03,19.43 C11.+ v13.3,22.2
  pour Top: 30.81,45.19 30.81,46.41 31.04,46.63 32.97,46.63 34.19,45.42 34.19,45.14 33.86,44.81 32.26,44.81 31.88,45.19
3.3V-WIFI  (via drill 0.41)
  Top 0.254: C45.1 30.88,33.62 v31.5,33 | C44.1 29.12,25.5 v29.25,25.5 | R125.2 v15.4,16.8 R124.2
  Top 0.406: MOD1.46 18.9,22.49 v19.25,22.14 19.6,22.49 MOD1.47
  Route3 0.406: v19.25,22.14 26.56,22.14 27.96,23.55 27.96,24 29.25,25.29 v29.25,25.5 29.25,25.69 27.13,27.81 27.13,29.95 27.89,30.71 29.21,30.71 v31.5,33 31.5,36.17 30.4,37.26 25.91,37.26 24.77,38.41 24.77,42.14 28.98,46.35 v29.08,46.35
  Route14 0.406: v15.4,16.8 15.4,18.29 v19.25,22.14
  Bottom 0.254: IC11.19 29.02,25.73 v29.25,25.5 | IC10.19 31.73,33.23 v31.5,33
  Bottom 0.406: v19.25,22.14 19.25,21.98 C61.1 18.38,20.07 C63.1
  pour Top: 20.57,44.32 20.57,45.85 21.84,45.85 22.23,46.23 22.23,48.26 22.73,48.26 22.99,48.51 29.08,48.51 29.72,47.88 29.72,46.61 29.97,46.35 29.97,45.21 28.96,45.21 28.96,43.31 27.81,43.31 27.56,43.56 27.56,44.96 27.3,45.21 24.77,45.21 24.38,44.83 24.38,44.45 24.26,44.32
5V_IN  (via drill 0.51)
  other vias: 30.48,41.91
  pour Top: 20.57,43.31 22.1,43.31 22.73,42.67 30.61,42.67 31.11,42.16 31.11,41.66 30.1,40.64 23.37,40.64 22.23,41.78 20.57,41.78
  pour Bottom: 28.45,43.18 33.4,43.18 33.4,40.64 28.45,40.64
12M_LOOP
  Bottom 0.152: IC13.2 IC13.3
12MHZ  (via drill 0.41)
  Top 0.152: IC9.27 69.2,34 68.66,33.45 v68.66,29.34
  Bottom 0.152: FB6.2 68.24,29.75 v68.66,29.34
32.768KHZ  (via drill 0.41)
  Top 0.152: MOD1.36 v11.9,22.2
  Bottom 0.152: OSC2.3 11.57,21.57 11.9,21.9 v11.9,22.2 12.8,23.1 R91.2
AGND  (via drill 0.41)
  Top 0.152: IC1.A9 v54.36,11.18
  Top 0.254: IC1.E8 v54.36,14.99 | IC1.A6 v58.17,9.91
  DigitalGND 0.254: P9.34 63.25,7.37 v63.25,9.02
  Bottom 0.254: v54.36,14.99 53.72,14.35 53.72,11.81 v54.36,11.18 55.63,9.91 v58.17,9.91 59.05,9.02 v63.25,9.02
AIN0  (via drill 0.41)
  Top 0.152: IC1.B6 v58.17,11.18 | v60.71,9.91 64.39,9.91 65.99,8.31 65.99,6.86 67.28,5.56 68.73,5.56 69.22,5.08 69.22,3.17 P9.39
  Bottom 0.152: v58.17,11.18 58.8,11.81 59.69,11.81 60.07,11.43 60.07,10.54 v60.71,9.91
AIN1
  Top 0.152: IC1.C7 57.05,12.29 57.05,10.01 59.36,7.7 59.36,6.93 59.66,6.63 65.76,6.63 P9.40
AIN2
  Top 0.152: IC1.B7 56.74,11.33 56.74,9.86 59.05,7.54 59.05,6.78 59.51,6.33 65.61,6.33 66.67,5.26 66.67,3.17 P9.37
AIN3
  Top 0.152: IC1.A7 56.26,9.88 58.75,7.39 58.75,6.63 59.36,6.02 63.83,6.02 P9.38
AIN4
  Top 0.152: IC1.C8 55.78,12.29 55.78,9.91 58.45,7.24 58.45,6.48 59.21,5.71 60.96,5.71 61.59,5.08 61.59,3.17 P9.33
AIN5  (via drill 0.41)
  Top 0.152: IC1.B8 55.47,11.33 55.47,9.75 57.84,7.39 v57.84,7.01
  Bottom 0.152: v57.84,7.01 58.98,5.87 61.44,5.87 P9.36
AIN6  (via drill 0.41)
  Top 0.152: IC1.A8 54.99,9.78 57,7.77 v57,7.01
  Bottom 0.152: v57,7.01 58.45,5.56 61.27,5.56 61.59,5.23 61.59,3.17 P9.35
AIN7  (via drill 0.41)
  Top 0.152: IC1.C9 54.36,12.45 v54.36,12.32
  Route14 0.152: v54.36,12.32 54.63,12.04 62.65,12.04 v63.25,12.64
  Bottom 0.152: v63.25,12.64 63.06,12.45 R21.2 R22.1
ALT.BT.EN
  Bottom 0.152: IC11.17 27.5,26.25 28,26.75 29.34,26.75 30.79,25.3 30.79,23.93 31.47,23.24 R135.2
ALT.BUFF.OE  (via drill 0.41)
  Top 0.152: R106.1 v29.5,38.62
  Route3 0.152: v29.49,28.27 35.51,34.29 35.51,36.5 32.77,39.24 30.12,39.24 v29.5,38.62
  Bottom 0.152: IC10.10 29.25,38.38 v29.5,38.62 | R131.1 31.2,26.75 30.1,26.75 29.49,27.36 v29.49,28.27 28.65,29.11 28.65,29.95 28.27,30.33 27.74,30.33 23.77,26.36 23.77,23.39 23.92,23.25 IC11.10
ALT.WL.CLK
  Bottom 0.152: R126.2 43.88,25.38 41.83,25.38 38.18,29.03 38.18,29.72 37.49,30.4 37.49,31.62 33.36,35.75 IC10.15
ALT.WL.CMD
  Bottom 0.152: R86.2 34.66,37.45 33.46,36.25 IC10.14
ALT.WL.D0
  Bottom 0.152: R130.2 30.75,32.74 IC10.20
ALT.WL.D1
  Bottom 0.152: R129.2 32.77,32.73 32.77,33.83 32.35,34.25 IC10.18
ALT.WL.D2
  Bottom 0.152: R128.2 33.53,33.98 32.76,34.75 IC10.17
ALT.WL.D3
  Bottom 0.152: R127.2 35.56,33.1 33.41,35.25 IC10.16
ALT.WL.EN
  Bottom 0.152: IC11.18 28,26.25 28.19,26.44 29.18,26.44 30.48,25.15 30.48,23.77 31.55,22.71 31.55,22.34 R136.2
ALT.WL.IRQ  (via drill 0.41)
  Route14 0.152: v31.17,21.03 28.57,21.03 25.68,23.93 25.68,26.75 v25.38,27.05
  Bottom 0.152: IC11.12 25,26.68 v25.38,27.05 | v31.17,21.03 31.33,20.87 31.33,20.52 R134.2
BAT_TEMP  (via drill 0.41)
  Top 0.152: IC1.W1 63.25,34.04 63.25,35.81 v62.48,36.58
  Route14 0.152: v65.66,23.24 66.22,23.8 66.22,25.38 65.68,25.91 65.68,32.08 63.55,34.21 63.55,35.2 62.48,36.27 v62.48,36.58
  DigitalGND 0.152: v65.66,23.24 62.84,26.06 51.89,26.06 50.52,24.69 33.6,24.69 27.36,18.44 23.93,18.44 17.27,11.79 TP4.P$1
BAT_VOLT  (via drill 0.41)
  Top 0.152: IC1.Y1 63.88,36.2 62.87,37.21 62.1,37.21 v61.47,36.58
  Route14 0.152: v65.66,25.02 65.38,25.3 65.38,31.93 63.25,34.06 63.25,35.05 62.23,36.07 61.98,36.07 v61.47,36.58
  DigitalGND 0.152: v65.66,25.02 64.36,25.02 63.02,26.36 51.74,26.36 50.37,24.99 33.45,24.99 27.2,18.75 23.77,18.75 16,10.97 16,9.4 TP3.P$1
BT_EN  (via drill 0.41)
  Top 0.152: MOD1.41 15.4,22.2 16.1,21.5 v16.1,21.1
  Route3 0.152: v16.1,21.1 16.1,20.7 16.31,20.5 16.31,15.01 v15.4,14.1
  Bottom 0.152: IC11.4 27.5,20.41 25.22,18.14 18.59,18.14 16.1,20.63 v16.1,21.1 16.3,21.1 R11.1 | T4.G 15.65,14.35 v15.4,14.1
BT_EN.SIP  (via drill 0.41)
  Top 0.152: IC1.K17 44.2,21.34 v44.2,21.21
  Bottom 0.152: v44.2,21.21 43.59,21.82 40.89,21.82 40.23,22.48 35.14,22.48 R135.1
BT_HCI_CTS  (via drill 0.41)
  Top 0.152: R141.2 25.45,23.2 25.45,21.39 v25.19,21.12
  Bottom 0.152: IC11.8 25.5,21.44 v25.19,21.12
BT_HCI_CTS.SIP  (via drill 0.41, 0.41 pad 0.25)
  Top 0.152: IC1.M17 42.93,23.88 v42.93,23.75 | v30.33,28.27 29.72,27.66 29.26,27.66 v28.65,28.27 28.65,29.68 R108.1
  Bottom 0.152: v42.93,23.75 42.37,24.31 41.38,24.31 40.77,23.7 37.95,23.7 33.68,27.96 30.63,27.96 v30.33,28.27 | IC11.15 26.5,26.25 28.52,28.27 v28.65,28.27
BT_HCI_RTS  (via drill 0.41)
  Top 0.152: R140.2 24.6,19.96 v25.19,19.38
  Bottom 0.152: IC11.6 26.5,20.69 v25.19,19.38
BT_HCI_RTS.SIP  (via drill 0.41, 0.41 pad 0.25)
  Top 0.152: IC1.M18 41.66,23.88 v41.66,23.75 | v30.33,27.36 29.41,27.36 28.88,26.82 28.42,26.82 27.43,27.81 27.43,29.11 v28.04,29.72 28.57,30.25 R109.1
  Bottom 0.152: v41.66,23.75 41.3,23.39 37.8,23.39 33.53,27.66 30.63,27.66 v30.33,27.36 | IC11.13 25.5,26.25 27.43,28.18 27.43,29.11 v28.04,29.72
BT_HCI_RX  (via drill 0.41)
  Top 0.152: v29.95,23.25 29.95,22.33 29.49,21.87 27.43,21.87 26.06,23.24 26.06,24.59 R143.2
  Bottom 0.152: IC11.1 v29.95,23.25
BT_HCI_RX.SIP  (via drill 0.41, 0.41 pad 0.25)
  Top 0.152: IC1.L17 43.05,22.73 v42.93,22.73
  Route14 0.152: v28.04,28.88 30.56,28.88 31.55,27.89 31.55,24.43 v31.34,24.23
  Bottom 0.152: v42.93,22.73 42.32,22.12 41.05,22.12 40.39,22.78 36.37,22.78 34.92,24.23 v31.34,24.23 | IC11.14 26,26.25 28.04,28.29 v28.04,28.88
BT_HCI_TX  (via drill 0.41)
  Top 0.152: R142.2 25.76,23.89 25.76,20.82 v25.19,20.25
  Bottom 0.152: IC11.7 26,21.06 v25.19,20.25
BT_HCI_TX.SIP  (via drill 0.41, 0.41 pad 0.25)
  Top 0.152: IC1.L16 44.32,22.73 v44.2,22.73
  DigitalGND 0.152: v36.73,25.76 36.27,25.3 33.3,25.3 31.62,23.62 30.63,23.62 30.25,24 v29.25,24
  Bottom 0.152: v44.2,22.73 43.51,23.42 43.51,24 42.9,24.61 41.22,24.61 40.62,24 38.1,24 36.73,25.38 v36.73,25.76 | IC11.20 28.98,24.27 v29.25,24
CEC  (via drill 0.41)
  Top 0.152: IC9.30 69.53,32.5 68.96,31.93 68.96,29.87 69.27,29.57 69.27,29.11 69.09,28.93 D1.C 69.5,27.34 69.72,27.56 69.72,27.94 69.98,28.19 70.74,28.19 71.09,27.84 v71.09,26.98
  Bottom 0.152: X5.15 71.92,26.15 v71.09,26.98
CGND  (via drill 0.41)
  Bottom 0.406: X2.CGND4 73.47,30.47 70.26,33.68 70.26,34.34 X2.CGND5 X2.CGND6 70.34,41.14 69.88,41.6 69.88,42.67 70.71,43.51 70.71,44.12 70.94,44.35 72.08,44.35 72.71,44.97 X2.CGND1 74.69,44.97 75.06,45.34 77.09,45.34 77.47,45.72
  other vias: 0.91,39.83 0.91,40.97 0.91,42.37 0.91,43.61 0.91,44.78 0.91,46.02 0.91,47.42 0.91,48.56 84.56,45.11 85.37,44.7 85.37,30.73 84.56,30.73
  pour Top: -3.81,27.3 -3.81,58.42 90.17,58.42 90.17,27.3 83.06,27.3 82.42,27.94 82.42,29.08 83.19,29.84 84.45,29.84 85.09,30.48 85.09,43.81 83.57,45.34 79.12,45.34 77.47,46.99 77.47,51.44 75.56,53.34 19.05,53.34 17.78,52.07 17.78,49.53 16.51,48.26 13.34,48.26 11.43,50.16 11.43,52.07 10.16,53.34 5.71,53.34 1.65,49.28 1.65,27.3
  pour Top: -3.81,27.3 -3.81,-3.81 90.17,-3.81 90.17,27.3 83.06,27.3 83.69,26.67 84.48,26.67 85.12,26.04 85.12,24.13 84.48,23.5 78.61,23.5 76.83,25.27 75.31,25.27 74.3,24.26 74.3,22.61 75.31,21.59 76.83,21.59 77.34,22.1 81.66,22.1 83.95,19.81 83.95,11.68 83.44,11.18 83.06,10.79 81.53,10.79 80.26,12.06 74.93,12.06 73.66,10.79 73.66,8.26 76.83,5.08 76.83,1.91 76.2,1.27 18.41,1.27 17.53,2.16 17.53,4.45 15.62,6.35 13.59,6.35 11.68,4.45 11.68,2.16 10.79,1.27 5.08,1.27 1.65,4.7 1.65,27.3
  pour Bottom: -3.81,27.3 -3.81,58.42 90.17,58.42 90.17,27.3 83.16,27.3 82.52,27.94 80.77,29.21 81.15,29.46 83.82,29.46 84.58,30.23 84.58,42.93 84.96,43.31 84.96,43.81 84.45,44.32 84.45,45.21 76.96,45.21 77.47,45.72 77.47,51.44 75.56,53.34 19.05,53.34 17.78,52.07 17.78,49.53 16.51,48.26 13.34,48.26 11.43,50.16 11.43,52.07 10.16,53.34 5.71,53.34 3.43,51.05 3.43,49.78 4.57,48.64 4.57,46.61 3.56,46.61 3.05,46.1 3.05,42.29 3.56,41.78 4.57,41.78 4.57,39.75 1.91,37.08 1.91,27.3
  pour Bottom: -3.81,27.3 -3.81,-3.81 90.17,-3.81 90.17,27.3 83.16,27.3 82.58,26.67 84.48,26.67 85.12,26.04 85.12,24.13 84.48,23.5 78.74,23.5 76.83,25.27 75.31,25.27 74.3,24.26 74.3,22.61 75.31,21.59 76.83,21.59 77.34,22.1 79.12,22.1 79.63,21.59 79.63,20.57 80.26,19.94 83.31,19.94 84.45,18.8 84.45,12.19 83.06,10.79 81.53,10.79 80.26,12.06 75.31,12.06 74.3,11.05 74.3,9.4 76.83,6.86 76.83,1.91 76.2,1.27 18.41,1.27 17.53,2.16 17.53,4.45 15.62,6.35 13.59,6.35 11.68,4.45 11.68,2.16 10.79,1.27 5.08,1.27 1.91,4.45 1.91,7.75 2.54,8.38 2.54,10.67 1.91,11.3 1.91,27.3
CLKOUT2  (via drill 0.41)
  Route14 0.152: v39.12,17.53 39.85,17.53 40.69,16.69 40.69,16 41.02,15.67 41.02,10.92 41.43,10.52 44.35,10.52 46.18,8.69 61.72,8.69 62.94,7.47 66.83,7.47 69.22,5.08 69.22,3.17 P9.41 | v28.65,27.43 28.65,25.22 29.11,24.77 29.72,24.77 34.04,20.45 v36.7,20.45
  Bottom 0.152: FB7.1 R14.1 69.22,5.72 69.22,3.17 P9.41 | P2.18 38.35,16.76 v39.12,17.53 39.12,18.03 v36.7,20.45 | IC11.16 27,26.25 27.8,27.05 28.27,27.05 v28.65,27.43
DVI_5V  (via drill 0.41, 0.51)
  Route3 0.813: v66.55,20.7 67.69,21.84 67.69,25.44 69.75,27.5 v70.35,27.5 70.92,28.07 74.3,28.07 75.06,27.3 v77.72,27.3
  Bottom 0.152: R118.1 70.35,27.6 | R115.1 70.35,27.6 | 70.35,27.6 v70.35,27.5
  Bottom 0.813: F1.1 66.8,20.45 v66.55,20.7
  pour Bottom: 80.26,26.92 77.6,26.92 77.34,27.18 77.34,27.43 77.6,27.69 80.26,27.69
EHRPWM1A  (via drill 0.41)
  Top 0.152: IC1.U14 v46.74,31.5
  Route3 0.152: v46.74,31.5 46.08,32.16 41.6,32.16 41.07,31.62 41.07,28.73 40.08,27.74 40.08,25.83 33.07,18.82 33.07,6.3 P9.14
EHRPWM1B  (via drill 0.41)
  Top 0.152: v46.74,30.23 IC1.T14
  Route3 0.152: v46.74,30.23 46.3,29.79 42.6,29.79 40.39,27.58 40.39,25.68 33.38,18.67 33.38,6.48 34.52,5.33 36.58,5.33 P9.16
EHRPWM2A  (via drill 0.41)
  Top 0.152: IC1.U10 51.82,30.23 v51.69,30.23
  Bottom 0.152: P8.19 41.91,49.53 41.27,49.53 39.24,47.5 39.24,37.95 40.54,36.65 43.51,36.65 44.81,35.36 47.93,35.36 49.68,33.6 49.68,31.55 50.22,31.01 50.98,31.01 51.69,30.3 v51.69,30.23
EHRPWM2B  (via drill 0.41)
  Top 0.152: IC1.T10 51.82,28.96 v51.69,28.96
  Bottom 0.152: v51.69,28.96 51.13,29.52 51.13,30.38 50.8,30.71 50.06,30.71 49.38,31.39 49.38,33.45 47.78,35.05 44.65,35.05 43.36,36.35 40.39,36.35 38.94,37.8 38.94,46.15 P8.13
EMMC_RSTN  (via drill 0.41)
  Top 0.152: IC22.K5 v46.94,42.31
  Bottom 0.152: R29.1 51.44,37.91 51.44,39.81 R33.1 49.76,40.31 48.23,41.83 47.42,41.83 v46.94,42.31
EXT_SWING  (via drill 0.41)
  Top 0.152: IC9.34 71.5,29.8 v72.25,29.05
  Bottom 0.152: R119.1 72.7,28.6 v72.25,29.05
GND  (via drill 0.41, 0.51)
  Top 0.152: v46.31,42.94 45.31,42.94 IC22.E7 | v46.31,42.94 46.31,41.94 IC22.G5 | IC22.H10 46.31,43.94 v46.31,42.94 | v46.31,42.94 47.31,42.94 IC22.K8 | 49.69,41.31 49.94,41.56 49.94,41.81 49.69,42.06 | 49.69,41.31 IC22.P4 49.69,41.06 | IC22.N5 49.44,42.06 | 49.44,42.06 IC22.P6 49.69,42.06 | IC9.53 79.83,33.5 80.08,33.75 | IC9.54 79.83,34 80.08,33.75 | 80.08,33.75 v80.4,33.75 | IC9.62 v80.08,38 | IC9.61 79.72,37.5 80.08,37.85 v80.08,38 | IC9.63 79.72,38.5 80.08,38.15 v80.08,38 | 74.75,40.4 75,40.15 IC9.8 | v74.75,40.5 74.75,40.4 | 74.75,40.4 74.5,40.15 IC9.9 | IC9.19 IC9.18 IC9.17 v70.35,39.65 IC9.16 | R87.1 R85.1 73.14,45.21 71.88,45.21 | R73.1 R75.1 70.37,45.21 71.63,45.21 | IC22.C4 45.06,40.19 45.06,39.69 45.31,39.44 v45.31,39.06 | IC22.N2 49.56,40.19 | 49.56,40.19 49.69,40.31 | 49.69,40.31 49.94,40.56 49.94,40.81 49.69,41.06 | v38.73,6.6 R52.2 36.07,7.1 36.07,7.37 C22.2 | IC14.4 C59.2 v6.48,45.97 | v18.8,43.81 IC18.3 | C64.2 v13.3,19.2 | IC9.65 v75.25,34.75 | v77.57,25.45 77.66,25.54 C56.2 80.78,25.54 C51.2 81.15,26.92 81.15,27.15 R114.1 | C1.2 79.9,43.56 78.87,43.56 77.74,42.43 S2.4 76.82,42.43 v75.56,43.69 74.31,42.43 S2.3 72.71,42.43 71.75,43.38 71.75,45.09 | 71.63,45.21 71.75,45.21 | 71.75,45.21 71.88,45.21 | C55.2 81.53,35.81 v81.92,36.2 | C53.2 83.28,31.47 v83.13,31.47 | C2.2 84.45,43.57 v84.35,43.66 | 71.75,45.09 71.75,45.21 | 71.75,45.09 71.88,45.21 | 71.75,45.09 71.63,45.21 | C22.2 35.18,7.87 34.92,7.62 v34.92,7.24 | C21.2 36.07,8.64 36.07,8.37 C22.2 | POWER.1 9.03,41.16 8.64,40.77 7.24,40.77 6.85,41.16 POWER.2 5.19,41.16 4.65,40.62 3.4,40.62 USR3.K USR2.K USR1.K USR0.K 2.42,48.6 3.05,49.23 4.04,49.23 4.8,49.99 4.8,51.82 5.17,52.19 RESET.1 7.8,52.19 v7.94,52.32 8.08,52.19 RESET.2
  Top 0.152: R106.2 v30.5,38.62 | 49.44,42.06 49.69,42.06 | 49.69,41.06 49.69,41.31 | 49.56,40.19 49.69,40.06 | 49.69,40.06 50.06,39.69 v50.06,39.25 | 49.69,40.06 49.69,40.31
  Top 0.254: IC4.2 v19.68,9.4 | C18.2 25.02,7.25 v25.02,7.37 | R55.1 v5.08,17.65 | v30.99,44.45 31.62,44.45 32.12,43.95 C8.2 | C44.2 26.75,24.12 IC11.TP 26.75,23.88 C43.2 | v34.92,7.24 33.91,7.24 33.66,7.49 33.66,9.78 33.39,10.05 IC2.3 32.72,10.58 32.5,10.81 C16.2 | R109.2 R108.2 29.84,32.41 30,32.56 30,34.12 | 29.81,34.31 C25.2 v30,35.88 C45.2 30.19,34.31 | 29.81,34.31 30,34.12 | 30.19,34.31 30,34.12 | 30.19,34.31 29.81,34.31
  Top 0.406: ANT2.GND1 4.2,37.1 v4.55,37.45 | ANT2.GND2 5.6,37.1 v5.25,37.45 | IC18.3 22.38,43.81 22.62,43.58 C20.2 24.27,43.58 24.66,43.97 C23.- | R94.2 19.57,50.05 P8.1 20.83,49.02 29.34,49.02 30.47,47.89 C10.2 | IC19.2 v30.99,44.45 | C19.2 25.27,39.12 v25.53,38.86
  Top 0.813: C62.- 71.07,7.29 71.75,6.6 71.75,5.71 P9.44
  Bottom 0.152: R69.1 | C35.2 C34.2 C33.2 C32.2 60.46,43.81 60.19,43.81 C30.2 | R69.1 R71.1 66.54,47.5 66.81,47.5 C36.2 C37.2 C38.2 C39.2 C42.2 C41.2 C40.2 | R69.1 R63.1 R67.1 | R67.1 R61.1 R65.1 | X5.10 v84.81,25.15 | IC17.4 48.12,14.87 v48.01,14.99 48.64,15.62 48.64,16 48.87,16.23 | 49.01,16.37 IC17.1 51.07,16.37 51.32,16.12 R123.2 | 49.01,16.37 48.87,16.23 | C49.2 48.51,16.88 48.87,16.51 | 48.87,16.51 49.01,16.37 | 48.87,16.51 48.87,16.23 | P2.8 38.35,10.41 38.48,10.54 38.48,11.56 | P2.10 38.35,11.68 | 38.35,11.68 38.48,11.81 | 38.48,11.81 38.48,12.19 v38.61,12.32 38.48,12.45 38.48,12.83 | P2.20 35.18,18.03 34.92,17.78 34.92,15.75 35.18,15.49 P2.16 38.35,15.49 38.48,15.37 38.48,13.08 | C47.2 v48.01,21.34 | OSC1.2 50.55,20.78 v50.55,21.34 | IC13.4 63.87,27.75 64.19,28.07 65.91,28.07 66.55,27.43 v66.55,27.05 67.5,28 C48.2 | C54.2 66.87,33.23 C52.2 68.07,34.43 v68.07,35.18 | R24.1 v63.25,11.18 | R22.2 61.98,14.22 v61.98,15.11 | C58.2 69.09,16.07 IC15.4 70.3,15.65 70.48,15.47 71.63,15.47 v71.93,15.77 | R19.2 78.23,18.67 78.74,18.16 IC12.9 78.74,16.64 77.96,15.85 IC12.1 | R27.2 46.69,26.25 v46.69,26.42 | C27.2 55.88,46.63 v56.52,46 | R57.1 57.15,46.63 v56.52,46 | v57.15,42.55 C31.2 C29.2 C30.2 | X2.6 83,31.33 v83.13,31.47 | R67.1 v62.23,46.23 | C30.2 60.33,42.68 v60.33,42.55 | X2.GND 72.36,33.94 72.75,33.55 v72.75,33.25 | IC8.3 IC8.8 v68.65,24.4 | IC7.3 IC7.8 v68.65,20.7 | v83.06,26.36 82.75,26.06 82.14,26.06 81.86,26.35 X5.16 | v83.06,23.93 82.75,24.23 82.14,24.23 81.86,23.95 X5.4 | R119.2 74.05,27.98 C57.2 | P2.4 35.18,7.87 34.92,7.62 v34.92,7.24 | 38.48,13.08 38.48,12.83 | 38.35,11.68 38.48,11.56 | 38.48,11.56 38.48,11.81
  Bottom 0.152: P2.12 38.35,12.95 | 38.35,12.95 38.48,13.08 | 38.35,12.95 38.48,12.83 | R95.2 30.95,40.23 v31.32,40.23 | IC10.11 30.75,38.38 v30.5,38.62 | v45.31,39.06 45.41,39.16 45.41,40.84 45.11,41.15 45.11,42.83 44.81,43.12 44.44,43.12 44.19,43.38 C12.2 45.69,44.38 46.31,43.75 v46.31,42.94 | v44.75,38.44 44.25,38.94 44.25,39.44 C69.2 44.19,40.5 C7.2 | C28.2 56.52,44.95 v56.52,46 | IC3.3 54.21,38.21 v53.95,37.95 | v50.06,39.25 49.56,38.75 C14.2 48.62,38.57 47.78,37.72 47.78,37.53 C13.2 v49,37.19 | v50.06,38.25 50.32,38.25 C15.2 | IC11.11 26,24.75 IC11.TP | R10.2 R11.2 19.6,22.9 20.12,22.38 C61.2 | X5.7 78.88,24.55 v78.64,24.31 | X5.13 77.87,25.75 v77.57,25.45
  Bottom 0.254: C50.2 74.67,28.23 C57.2 72.77,27.35 v72.54,27.13 | C24.2 10.1,20.7 10.1,22.7 10.22,22.82 OSC2.2 10.93,23.73 v10.32,24.32 | T3.S 15.1,15 v15.4,15 15.7,15 T4.S | IC10.TP v30,35.88
  Bottom 0.406: D8.2 33.55,40.01 31.55,40.01 v31.32,40.23 | v51.44,41.81 51.44,42.19 C9.2 50.5,44.12 C17.2 | v21.2,21.1 C61.2 20.12,20.07 C63.2 | C11.- v13.3,19.2
  Bottom 0.813: R17.1 X12.OUT